# Altium project Iris.PrjPCB (part 2 of 2)

## Sheet Audio.SchDoc: Iris
size A3; Organization: Toradex AG; Address1: Altsagenstrasse 5; Address2: Horw; Address3: 6048; Address4: Switzerland; DocumentNumber: 13; Revision: V2.0; SheetNumber: 13; SheetTotal: 16
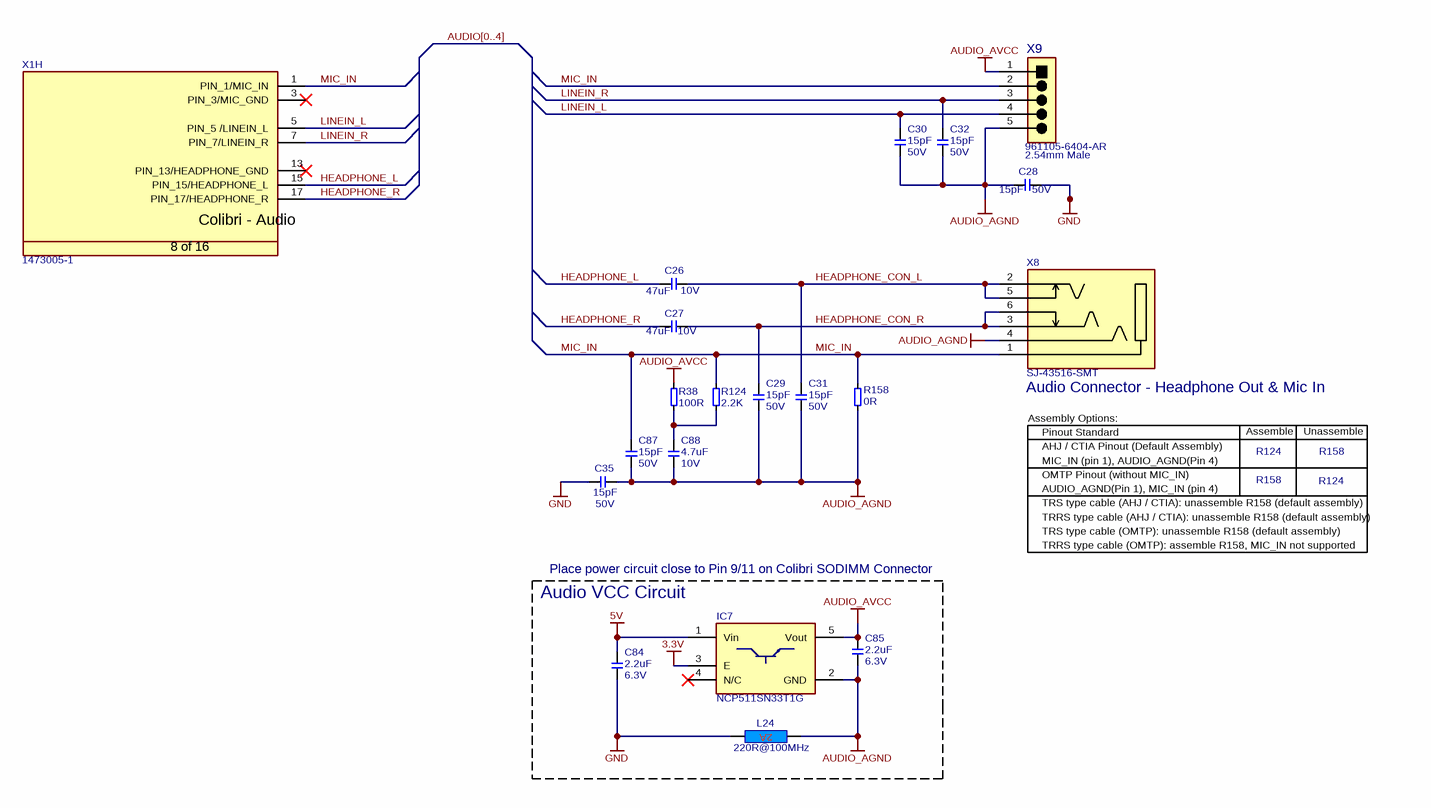
[diagram p9: Audio.SchDoc]

### Parts
C26  Rating: 10V  [T_CAPC0805X125N]  (hidden comment: 47uF)
C27  Rating: 10V  [T_CAPC0805X125N]  (hidden comment: 47uF)
C28  Rating: 50V  [CAPC1005X60N]  (hidden comment: 15pF)
C29  Rating: 50V  [CAPC1005X60N]  (hidden comment: 15pF)
C30  Rating: 50V  [CAPC1005X60N]  (hidden comment: 15pF)
C31  Rating: 50V  [CAPC1005X60N]  (hidden comment: 15pF)
C32  Rating: 50V  [CAPC1005X60N]  (hidden comment: 15pF)
C35  Rating: 50V  [CAPC1005X60N]  (hidden comment: 15pF)
C84  Rating: 6.3V  [T_CAPC0603X33N]  (hidden comment: 2.2uF)
C85  Rating: 6.3V  [T_CAPC0603X33N]  (hidden comment: 2.2uF)
C87  Rating: 50V  [CAPC1005X60N]  (hidden comment: 15pF)
C88  Rating: 10V  [T_CAPC0603X33N]  (hidden comment: 4.7uF)
IC7  NCP511SN33T1G  [SOT95P279X142-5N]
L24  220R@100MHz  [INDC1608X95N]
R38  100R  [T_RESC0603X30N]
R124  2.2K  [RESC1005X40N]
R158  0R  [T_RESC0603X30N]
X1  1473005-1  [T_Tyco_1473005-1]  (part H of 16)
X8  SJ-43516-SMT  [T_CI_SJ-43516-SMT]
X9  961105-6404-AR  [T_3M_961105-6404-AR]

### Blocks framed on the sheet
Audio VCC Circuit: C84 C85 IC7 L24

### Nets
3.3V: IC7.3(E)
5V: C84.2 IC7.1(Vin)
AUDIO_AGND: C28.1 C29.1 C30.1 C31.1 C32.1 C35.2 C85.1 C87.1 C88.1 IC7.2(GND) L24.1 R158.2 X8.4 X9.5
AUDIO_AVCC: C85.2 IC7.5(Vout) R38.1 X9.1
GND: C28.2 C35.1 C84.1 L24.2
HEADPHONE_CON_L: C26.2 C31.2 X8.2 X8.5
HEADPHONE_CON_R: C27.2 C29.2 X8.3 X8.6
HEADPHONE_L: C26.1 X1.15(PIN_15/HEADPHONE_L)
HEADPHONE_R: C27.1 X1.17(PIN_17/HEADPHONE_R)
LINEIN_L: C30.2 X1.5(PIN_5_/LINEIN_L) X9.4
LINEIN_R: C32.2 X1.7(PIN_7/LINEIN_R) X9.3
MIC_IN: C87.2 R124.2 R158.1 X1.1(PIN_1/MIC_IN) X8.1 X9.2
NetC88_2: C88.2 R38.2 R124.1

Not connected (* = marked no-connect by the designer): IC7 4(N/C)*; X1 3(PIN_3/MIC_GND)* 13(PIN_13/HEADPHONE_GND)*

### Buses and harness runs
bus AUDIO[0..4]

### Notes on the sheet
- 2.54mm Male
- (near X8) Audio Connector - Headphone Out & Mic In
- Assembly Options:
- AHJ / CTIA Pinout (Default Assembly)
- Pinout Standard
- Assemble
- R124
- Unassemble
- R158
- OMTP Pinout (without MIC_IN)
- MIC_IN (pin 1), AUDIO_AGND(Pin 4)
- AUDIO_AGND(Pin 1), MIC_IN (pin 4)
- TRS type cable (AHJ / CTIA): unassemble R158 (default assembly)
- TRRS type cable (AHJ / CTIA): unassemble R158 (default assembly)
- Place power circuit close to Pin 9/11 on Colibri SODIMM Connector
- TRRS type cable (OMTP): assemble R158, MIC_IN not supported
- TRS type cable (OMTP): unassemble R158 (default assembly)
- Title
- Size:
- Date:
- A3
- Number:
- Time:
- Revision:
- Sheet
- of
- File:
- (in symbol CON-Tyco-1473005-1-200-0.6mm, part H) Colibri - Audio; 8 of 16

### Library data of the parts
C26 C27 = C-X5R-47uF-10V-20%-0805: Capacitor Ceramic X5R 47uF 10V 20% 0805; Tolerance: 20%; Type: X5R; Value: 47uF
C28-C32 C35 C87 = C-NPO-15pF-50V-5%-0402: Capacitor Ceramic NPO 15pF 50V 5% 0402; Tolerance: 5%; Type: NPO; Value: 15pF
C84 C85 = C-X5R-2.2uF-6.3V-20%-0603: Capacitor Ceramic X5R 2.2uF 6.3V 20% 0603; Tolerance: 20%; Type: X5R; Value: 2.2uF
C88 = C-X5R-4.7uF-10V-10%-0603: Capacitor Ceramic X5R 4.7uF 10V 10% 0603; Manufacturer Name: Generic; Tolerance: 10%; Type: X5R; Manufacturer Part No.: *; Value: 4.7uF
IC7 = IC-ON-NCP511SN33T1G: NCP511SN33T1G LDO Regulator; Manufacturer Name: ON Semiconductor; Manufacturer Part No.: NCP511SN33T1G
L24 = L-220R@100MHz-2A-25%-0603: as L19 on sheet Ethernet; Rating: 2A; Value: 220R@100MHz
R38 = R-100R-63mW-5%-0603: Resistor 100 ohm 63mW 5% 0603; Rating: 63mW; Tolerance: 5%; Value: 100R
R124 = R-2.2KR-63mW-5%-0402: Resistor 2.2 Kohm 63mW 5% 0402; Value: 2.2KR; Rating: 63mW; Tolerance: 5%
R158 = R-0R-63mW-5%-0603: Resistor 0 ohm 63mW 5% 0603; Rating: 63mW; Tolerance: 5%; Value: 0R; Size: 0603 (In)
X1 = CON-Tyco-1473005-1-200-0.6mm: as X1 on sheet Colibri; Manufacturer Part No.: 1473005-1
X8 = CON-Cui-SJ-43516-SMT-6-3.5mm: 3.5mm Stereo Jack SMD with Detect Contact; Manufacturer Name: Cui INC; No. of ways: 6; Manufacturer Part No.: SJ-43516-SMT
X9 = CON-3M-961105-6404-AR: Audio Header 5 pins 2.54mm; Manufacturer Name: 3M; No. of ways: 1X5; Pitch: 2.54mm; Manufacturer Part No.: 961105-6404-AR

## Sheet USB.SchDoc: Iris
size A3; Organization: Toradex AG; Address1: Altsagenstrasse 5; Address2: Horw; Address3: 6048; Address4: Switzerland; DocumentNumber: 6; Revision: V2.0; SheetNumber: 6; SheetTotal: 16
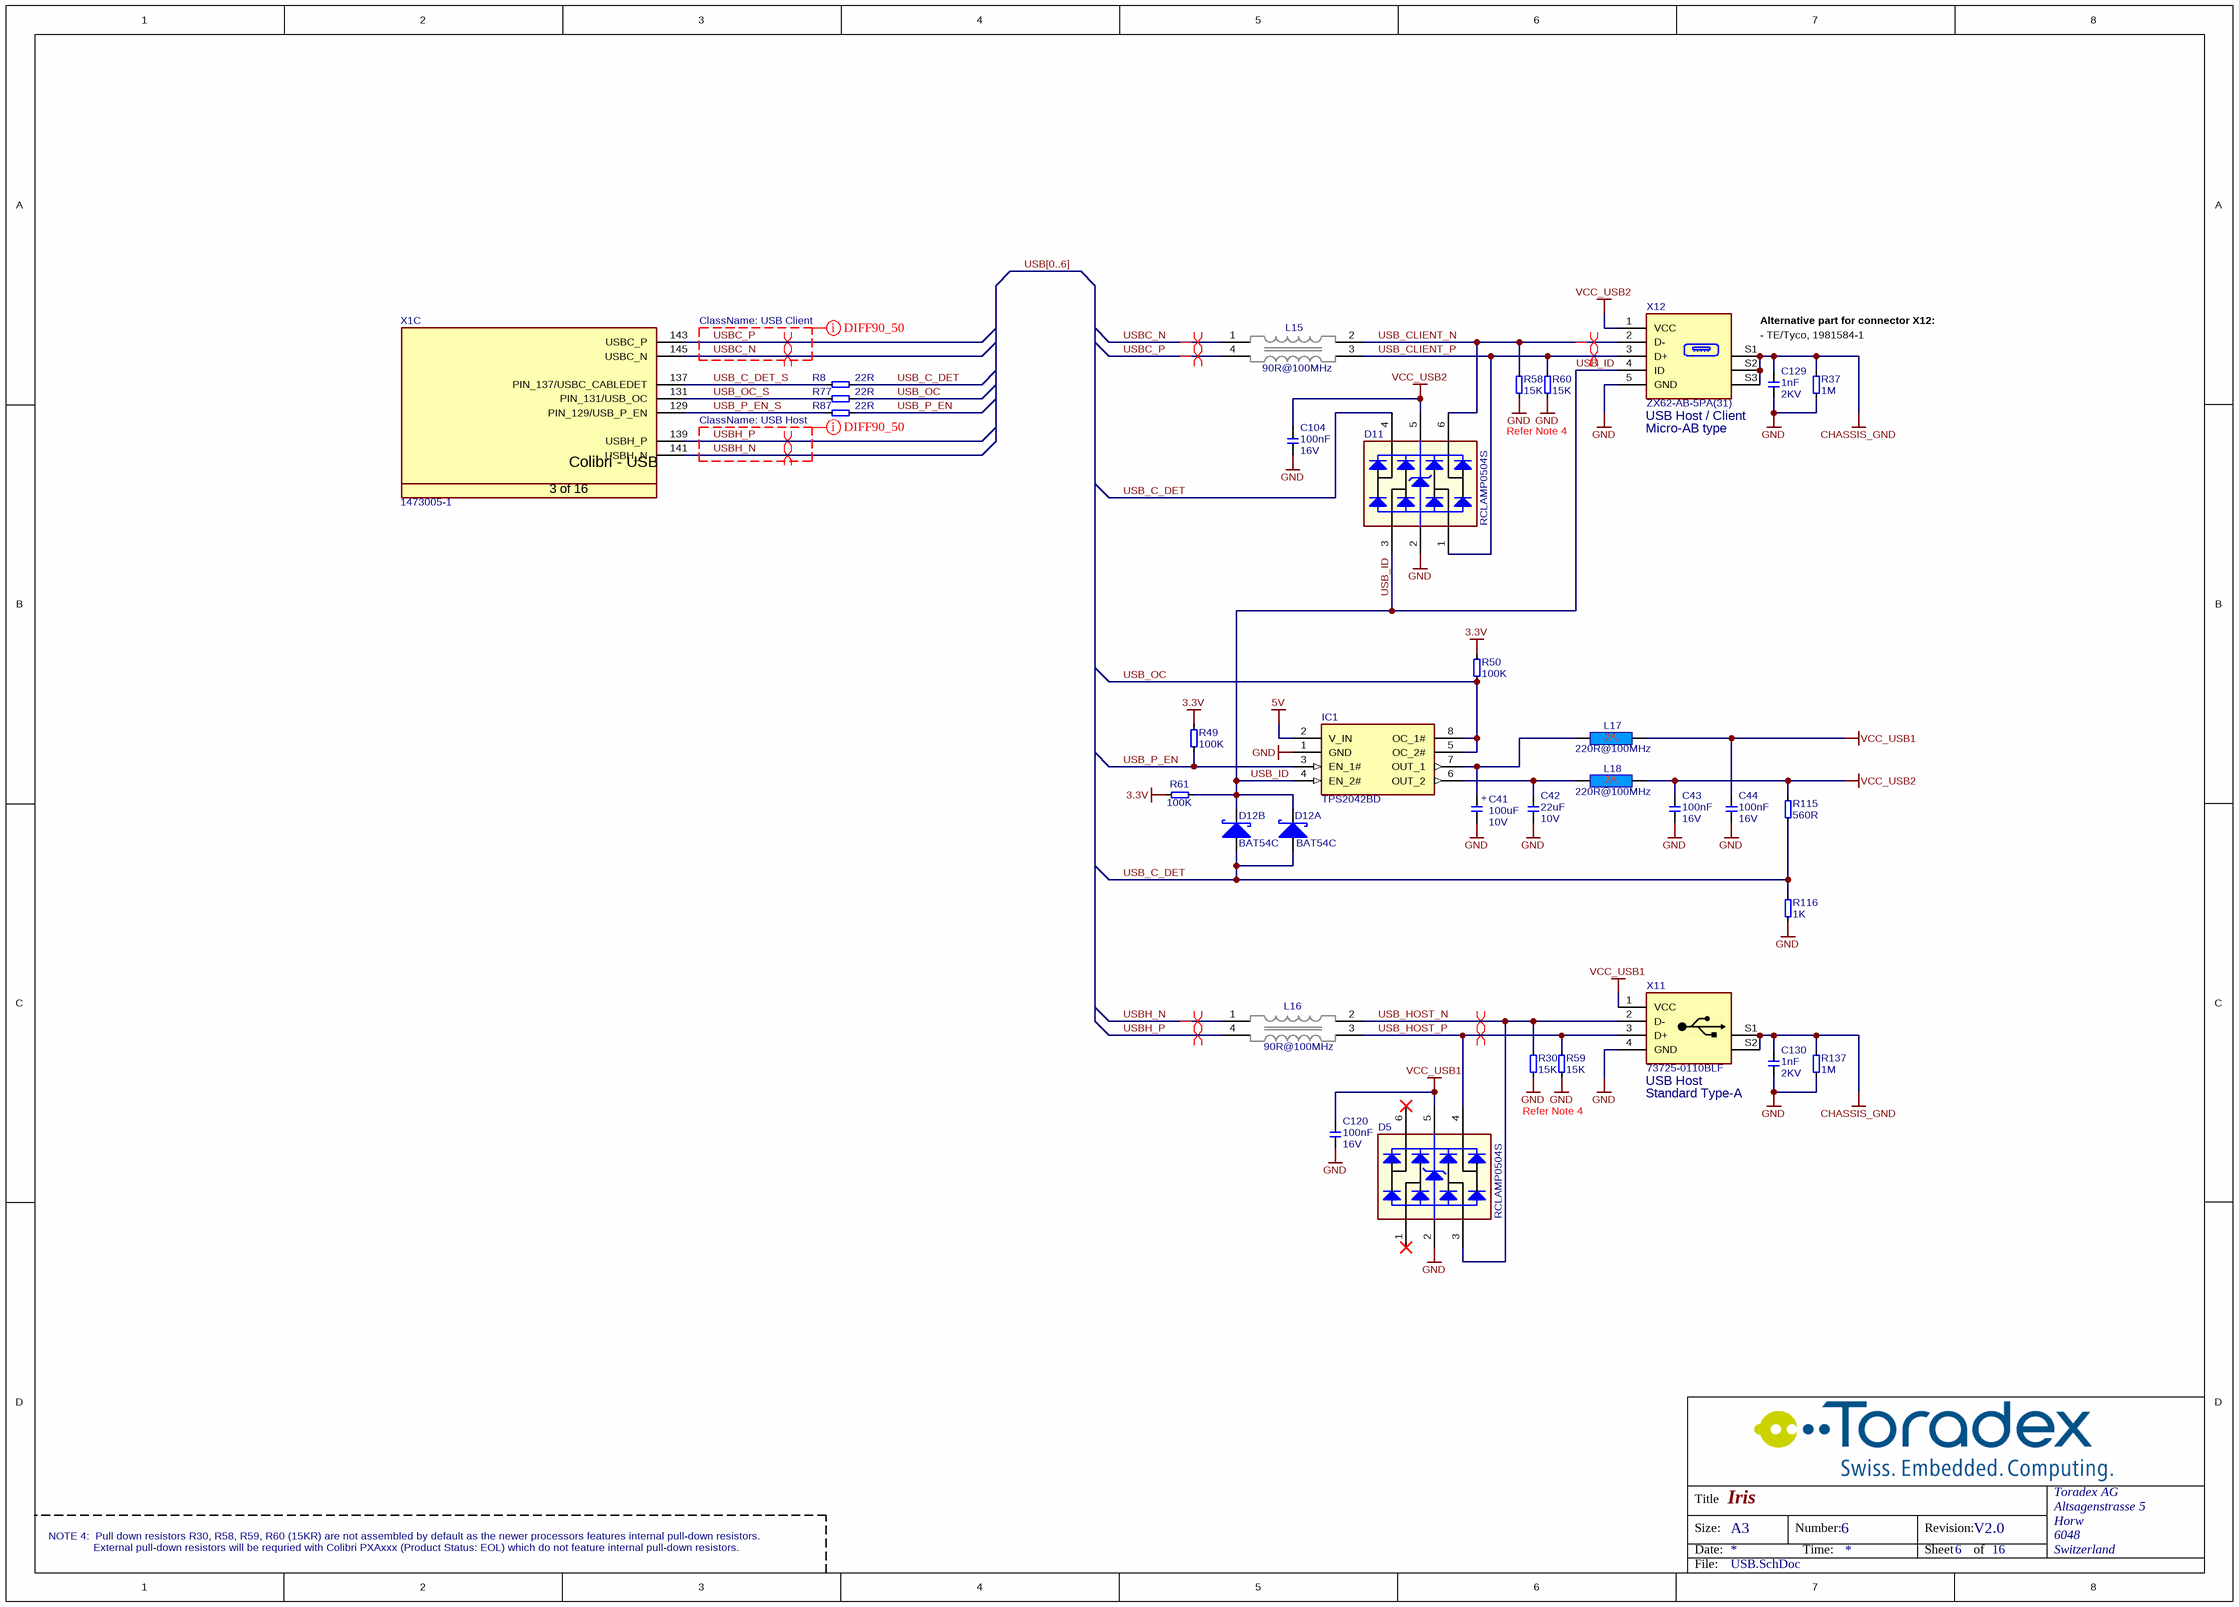
[diagram p10: USB.SchDoc]

### Parts
C41  Rating: 10V  [CAPMP3528X210N]  (hidden comment: 100uF)
C42  Rating: 10V  [T_CAPC0805X125N]  (hidden comment: 22uF)
C43  Rating: 16V  [CAPC1005X60N]  (hidden comment: 100nF)
C44  Rating: 16V  [CAPC1005X60N]  (hidden comment: 100nF)
C104  Rating: 16V  [CAPC1005X60N]  (hidden comment: 100nF)
C120  Rating: 16V  [CAPC1005X60N]  (hidden comment: 100nF)
C129  Rating: 2KV  [T_CAPC1206X180N]  (hidden comment: 1nF)
C130  Rating: 2KV  [T_CAPC1206X180N]  (hidden comment: 1nF)
D5  RCLAMP0504S  [T_SOT95P285X90-6N]
D11  RCLAMP0504S  [T_SOT95P285X90-6N]
D12  BAT54C  [SOT95P230X110-3N]  (parts A,B of 2)
IC1  TPS2042BD  [SOIC127P600X173-8N]
L15  90R@100MHz  [T_Murata_DLW21SN900SQ2]
L16  90R@100MHz  [T_Murata_DLW21SN900SQ2]
L17  220R@100MHz  [INDC1608X95N]
L18  220R@100MHz  [INDC1608X95N]
R8  22R  [RESC1005X40N]
R30  15K  [T_RESC0603X30N]
R37  1M  [T_RESC0603X30N]
R49  100K  [RESC1005X40N]
R50  100K  [RESC1005X40N]
R58  15K  [T_RESC0603X30N]
R59  15K  [T_RESC0603X30N]
R60  15K  [T_RESC0603X30N]
R61  100K  [RESC1005X40N]
R77  22R  [RESC1005X40N]
R87  22R  [RESC1005X40N]
R115  560R  [RESC1005X40N]
R116  1K  [RESC1005X40N]
R137  1M  [T_RESC0603X30N]
X1  1473005-1  [T_Tyco_1473005-1]  (part C of 16)
X11  Manufacturer Part No.: 73725-0110BLF  [T_FCI_73725-0110BLF]  (hidden comment: CON-Fci-73725-0110BLF)
X12  ZX62-AB-5PA(31)  [CON-MicroUSB2.0-Type_AB-SMD]

### Nets
3.3V: R49.2 R50.2 R61.2
5V: IC1.2(V_IN)
CHASSIS_GND: C129.2 C130.2 R37.2 R137.2 X11.S1 X11.S2 X12.S1 X12.S2 X12.S3
GND: C41.2 C42.1 C43.1 C44.1 C104.1 C120.1 C129.1 C130.1 D5.2 D11.2 IC1.1(GND) R30.1 R37.1 R58.1 R59.1 R60.1 R116.2 R137.1 X11.4(GND) X12.5(GND)
VCC_USB1: C44.2 C120.2 D5.5 L17.2 X11.1(VCC)
VCC_USB2: C43.2 C104.2 D11.5 L18.2 R115.1 X12.1(VCC)
USB_C_DET: D11.4 D12.1 D12.2 R8.2 R115.2 R116.1
USB_C_DET_S: R8.1 X1.137(PIN_137/USBC_CABLEDET)
USB_CLIENT_N: D11.6 L15.2 R58.2 X12.2(D-)
USB_CLIENT_P: D11.1 L15.3 R60.2 X12.3(D+)
USB_HOST_N: D5.3 L16.2 R30.2 X11.2(D-)
USB_HOST_P: D5.4 L16.3 R59.2 X11.3(D+)
USB_ID: D11.3 D12.3 IC1.4(EN_2#) R61.1 X12.4(ID)
USB_OC: IC1.5(OC_2#) IC1.8(OC_1#) R50.1 R77.2
USB_OC_S: R77.1 X1.131(PIN_131/USB_OC)
USB_P_EN: IC1.3(EN_1#) R49.1 R87.2
USB_P_EN_S: R87.1 X1.129(PIN_129/USB_P_EN)
USBC_N: L15.1 X1.145(USBC_N)
USBC_P: L15.4 X1.143(USBC_P)
USBH_N: L16.1 X1.141(USBH_N)
USBH_P: L16.4 X1.139(USBH_P)
NetC41_1: C41.1 IC1.7(OUT_1) L17.1
NetC42_2: C42.2 IC1.6(OUT_2) L18.1

Not connected (* = marked no-connect by the designer): D5 1* 6*

### Buses and harness runs
bus USB[0..6]

### Layout directives
differential pair: USB_CLIENT_N, USB_CLIENT_P, USB_HOST_N, USB_HOST_P, USBC_N, USBC_P, USBH_N, USBH_P
net class USB Client: USBC_N, USBC_P
net class USB Host: USBH_N, USBH_P

### Notes on the sheet
- (near X12) Alternative part for connector X12:
- - TE/Tyco, 1981584-1
- Refer Note 4
- USB Host / Client
- Micro-AB type
- (near X11) USB Host
- Standard Type-A
- NOTE 4:  Pull down resistors R30, R58, R59, R60 (15KR) are not assembled by default as the newer processors features internal pull-down resistors.
- External pull-down resistors will be requried with Colibri PXAxxx (Product Status: EOL) which do not feature internal pull-down resistors.
- Title
- Size:
- Date:
- A3
- Number:
- Time:
- Revision:
- Sheet
- of
- File:
- (in symbol C-TA-100uF-10V-20%-3528) +
- (in symbol CON-Tyco-1473005-1-200-0.6mm, part C) Colibri - USB; 3 of 16

### Library data of the parts
C41 = C-TA-100uF-10V-20%-3528: Capacitor TA 100uF 10V 20% 3528; Tolerance: 20%; Type: TA; Value: 100uF
C42 = C-X5R-22uF-10V-20%-0805: Capacitor Ceramic X5R 22uF 10V 20% 0805; Tolerance: 20%; Type: X5R; Value: 22uF
C43 C44 C104 C120 = C-X7R-100nF-16V-10%-0402: Capacitor Ceramic X7R 100nF 16V 10% 0402; Tolerance: 10%; Type: X7R; Value: 100nF
C129 C130 = C-X7R-1nF-2KV-10%-1206: Capacitor Ceramic X7R 1nF 2KV 10% 1206; Tolerance: 10%; Type: X7R; Value: 1nF
D5 D11 = D-Semtech-RClamp0504S: TVS Array low cap; Manufacturer Name: Semtech; Manufacturer Part No.: RCLAMP0504S
D12 = D-Philips-BAT54C-Schottky: BAT54C Schottky Diode; Manufacturer Name: Philips; Manufacturer Part No.: BAT54C
IC1 = IC-TI-TPS2042BD: Dual High Side Switch With OC_DET 500mA/CH; Manufacturer Name: Texas Instruments; Manufacturer Part No.: TPS2042BD
L15 L16 = L-Murata-DLW21SN900SQ2-90R@100MHz-330mA-25%: Common Mode Choke High Speed 90R 330mA; Manufacturer Name: Murata; Tolerance: 25%; Rating: 330mA; Manufacturer Part No.: DLW21SN900SQ2; Value: 90R@100MHz
L17 L18 = L-220R@100MHz-2A-25%-0603: 220R@100MHz 2A EMI FILTER; Tolerance: 25%; Rating: 2A; Value: 220R@100MHz
R8 R77 R87 = R-22R-63mW-5%-0402: Resistor 22 ohm 63mW 5% 0402; Rating: 63mW; Tolerance: 5%; Value: 22R
R30 R58-R60 = R-15KR-63mW-5%-0603: Resistor 15 Kohm 63mW 5% 0603; Value: 15KR; Rating: 63mW; Tolerance: 5%
R37 R137 = R-1MR-63mW-5%-0603: Resistor 1 Mohm 63mW 5% 0603; Value: 1MR; Rating: 63mW; Tolerance: 5%
R49 R50 R61 = R-100KR-63mW-5%-0402: Resistor 100 Kohm 63mW 5% 0402; Value: 100KR; Rating: 63mW; Tolerance: 5%
R115 = R-560R-63mW-5%-0402: Resistor 560 ohm 63mW 5% 0402; Rating: 63mW; Tolerance: 5%; Value: 560R
R116 = R-1KR-63mW-5%-0402: Resistor 1 Kohm 63mW 5% 0402; Rating: 63mW; Tolerance: 5%; Value: 1K
X1 = CON-Tyco-1473005-1-200-0.6mm: SODIMM Connector; Manufacturer Name: Tyco; No. of ways: 200; Manufacturer Part No.: 1473005-1
X11 = CON-Fci-73725-0110BLF: USB Type A Connector; Manufacturer Name: FCI; No. of ways: 4
X12 = CON-Hirose-ZX62-AB-5PA(31): Micro AB USB-2.0, 5 Position, Surface Mount, Right Angle, Horizontal; Manufacturer Name: Hirose; No. of ways: 5; Manufacturer Part No.: ZX62-AB-5PA(31)

## Sheet Serial.SchDoc: Iris
size A3; Organization: Toradex AG; Address1: Altsagenstrasse 5; Address2: Horw; Address3: 6048; Address4: Switzerland; DocumentNumber: 14; Revision: V2.0; SheetNumber: 14; SheetTotal: 16
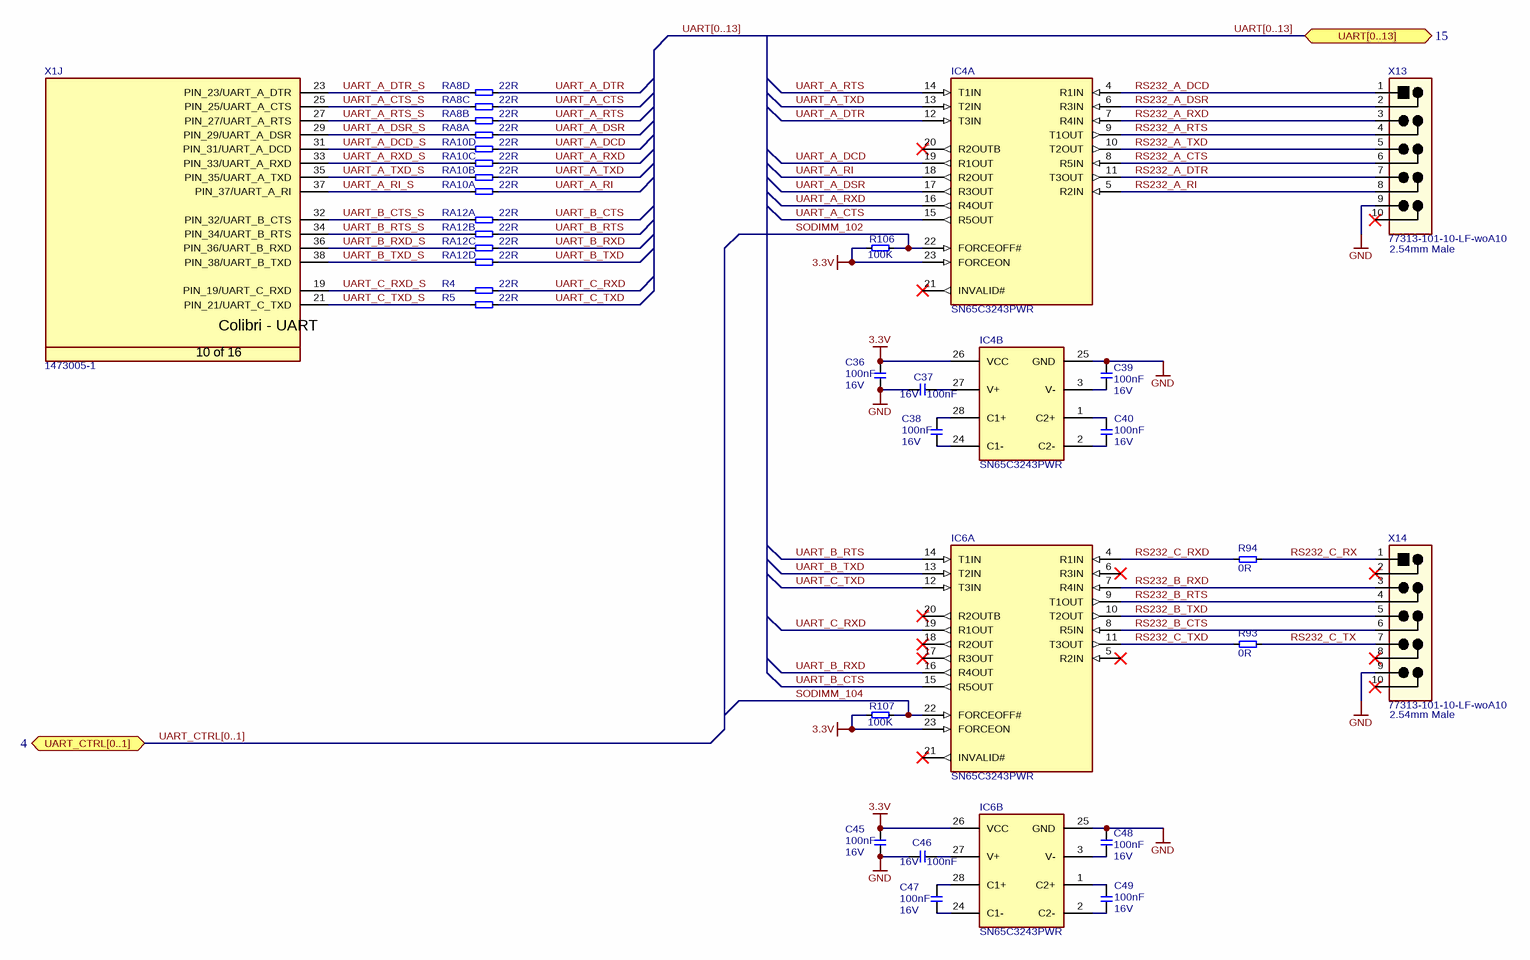
[diagram p11: Serial.SchDoc]

### Parts
C36  Rating: 16V  [CAPC1005X60N]  (hidden comment: 100nF)
C37  Rating: 16V  [CAPC1005X60N]  (hidden comment: 100nF)
C38  Rating: 16V  [CAPC1005X60N]  (hidden comment: 100nF)
C39  Rating: 16V  [CAPC1005X60N]  (hidden comment: 100nF)
C40  Rating: 16V  [CAPC1005X60N]  (hidden comment: 100nF)
C45  Rating: 16V  [CAPC1005X60N]  (hidden comment: 100nF)
C46  Rating: 16V  [CAPC1005X60N]  (hidden comment: 100nF)
C47  Rating: 16V  [CAPC1005X60N]  (hidden comment: 100nF)
C48  Rating: 16V  [CAPC1005X60N]  (hidden comment: 100nF)
C49  Rating: 16V  [CAPC1005X60N]  (hidden comment: 100nF)
IC4  SN65C3243PWR  [SOP65P780X200-28N]  (parts A,B of 2)
IC6  SN65C3243PWR  [SOP65P780X200-28N]  (parts A,B of 2)
R4  22R  [RESC1005X40N]
R5  22R  [RESC1005X40N]
R93  0R  [T_RESC0603X30N]
R94  0R  [T_RESC0603X30N]
R106  100K  [T_RESC0603X30N]
R107  100K  [T_RESC0603X30N]
RA8  22R  [T_Resistor_Array_X4]  (parts A,B,C,D of 4)
RA10  22R  [T_Resistor_Array_X4]  (parts A,B,C,D of 4)
RA12  22R  [T_Resistor_Array_X4]  (parts A,B,C,D of 4)
X1  1473005-1  [T_Tyco_1473005-1]  (part J of 16)
X13  77313-101-10-LF-woA10  [T_FCI_77313-101-10-LF-woA10]
X14  77313-101-10-LF-woA10  [T_FCI_77313-101-10-LF-woA10]

### Ports
UART[0..13] (bidir, see 15), UART_CTRL[0..1] (bidir, see 4)

### Nets
3.3V: C36.2 C45.2 IC4.23(FORCEON) IC4.26(VCC) IC6.23(FORCEON) IC6.26(VCC) R106.1 R107.1
GND: C36.1 C37.1 C39.2 C45.1 C46.1 C48.2 IC4.25(GND) IC6.25(GND) X13.9 X14.9
RS232_A_CTS: IC4.8(R5IN) X13.6
RS232_A_DCD: IC4.4(R1IN) X13.1
RS232_A_DSR: IC4.6(R3IN) X13.2
RS232_A_DTR: IC4.11(T3OUT) X13.7
RS232_A_RI: IC4.5(R2IN) X13.8
RS232_A_RTS: IC4.9(T1OUT) X13.4
RS232_A_RXD: IC4.7(R4IN) X13.3
RS232_A_TXD: IC4.10(T2OUT) X13.5
RS232_B_CTS: IC6.8(R5IN) X14.6
RS232_B_RTS: IC6.9(T1OUT) X14.4
RS232_B_RXD: IC6.7(R4IN) X14.3
RS232_B_TXD: IC6.10(T2OUT) X14.5
RS232_C_RX: R94.2 X14.1
RS232_C_RXD: IC6.4(R1IN) R94.1
RS232_C_TX: R93.2 X14.7
RS232_C_TXD: IC6.11(T3OUT) R93.1
SODIMM_102: IC4.22(FORCEOFF#) R106.2
SODIMM_104: IC6.22(FORCEOFF#) R107.2
UART_A_CTS: IC4.15(R5OUT) RA8.7
UART_A_CTS_S: RA8.3 X1.25(PIN_25/UART_A_CTS)
UART_A_DCD: IC4.19(R1OUT) RA10.8
UART_A_DCD_S: RA10.4 X1.31(PIN_31/UART_A_DCD)
UART_A_DSR: IC4.17(R3OUT) RA8.5
UART_A_DSR_S: RA8.1 X1.29(PIN_29/UART_A_DSR)
UART_A_DTR: IC4.12(T3IN) RA8.8
UART_A_DTR_S: RA8.4 X1.23(PIN_23/UART_A_DTR)
UART_A_RI: IC4.18(R2OUT) RA10.5
UART_A_RI_S: RA10.1 X1.37(PIN_37/UART_A_RI)
UART_A_RTS: IC4.14(T1IN) RA8.6
UART_A_RTS_S: RA8.2 X1.27(PIN_27/UART_A_RTS)
UART_A_RXD: IC4.16(R4OUT) RA10.7
UART_A_RXD_S: RA10.3 X1.33(PIN_33/UART_A_RXD)
UART_A_TXD: IC4.13(T2IN) RA10.6
UART_A_TXD_S: RA10.2 X1.35(PIN_35/UART_A_TXD)
UART_B_CTS: IC6.15(R5OUT) RA12.5
UART_B_CTS_S: RA12.1 X1.32(PIN_32/UART_B_CTS)
UART_B_RTS: IC6.14(T1IN) RA12.6
UART_B_RTS_S: RA12.2 X1.34(PIN_34/UART_B_RTS)
UART_B_RXD: IC6.16(R4OUT) RA12.7
UART_B_RXD_S: RA12.3 X1.36(PIN_36/UART_B_RXD)
UART_B_TXD: IC6.13(T2IN) RA12.8
UART_B_TXD_S: RA12.4 X1.38(PIN_38/UART_B_TXD)
UART_C_RXD: IC6.19(R1OUT) R4.2
UART_C_RXD_S: R4.1 X1.19(PIN_19/UART_C_RXD)
UART_C_TXD: IC6.12(T3IN) R5.2
UART_C_TXD_S: R5.1 X1.21(PIN_21/UART_C_TXD)
NetC37_2: C37.2 IC4.27(V+)
NetC38_1: C38.1 IC4.24(C1-)
NetC38_2: C38.2 IC4.28(C1+)
NetC39_1: C39.1 IC4.3(V-)
NetC40_1: C40.1 IC4.2(C2-)
NetC40_2: C40.2 IC4.1(C2+)
NetC46_2: C46.2 IC6.27(V+)
NetC47_1: C47.1 IC6.24(C1-)
NetC47_2: C47.2 IC6.28(C1+)
NetC48_1: C48.1 IC6.3(V-)
NetC49_1: C49.1 IC6.2(C2-)
NetC49_2: C49.2 IC6.1(C2+)

Not connected (* = marked no-connect by the designer): IC4 20(R2OUTB)* 21(INVALID#)*; IC6 5(R2IN)* 6(R3IN)* 17(R3OUT)* 18(R2OUT)* 20(R2OUTB)* 21(INVALID#)*; X13 10*; X14 2* 8* 10*

### Buses and harness runs
bus UART[0..13] = port UART[0..13]
bus UART_CTRL[0..1] = port UART_CTRL[0..1]

### Notes on the sheet
- (near X13) 2.54mm Male
- (near X14) 2.54mm Male
- Title
- Size:
- Date:
- A3
- Number:
- Time:
- Revision:
- Sheet
- of
- File:
- (in symbol CON-Tyco-1473005-1-200-0.6mm, part J) Colibri - UART; 10 of 16

### Library data of the parts
C36-C40 C45-C49 = C-X7R-100nF-16V-10%-0402: Capacitor Ceramic X7R 100nF 16V 10% 0402; Tolerance: 10%; Type: X7R; Value: 100nF
IC4 IC6 = IC-TI-SN65C3243PWR: RS-232 Serial Transceiver; Manufacturer Name: Texas Instruments; Manufacturer Part No.: SN65C3243PWR
R4 R5 = R-22R-63mW-5%-0402: Resistor 22 ohm 63mW 5% 0402; Rating: 63mW; Tolerance: 5%; Value: 22R
R93 R94 = R-0R-63mW-5%-0603: Resistor 0 ohm 63mW 5% 0603; Tolerance: 5%; Value: 0R; Rating: 63mW; Size: 0603 (In)
R106 R107 = R-100KR-63mW-5%-0603: Resistor 100 Kohm 63mW 5% 0603; Value: 100KR; Rating: 63mW; Tolerance: 5%
RA8 RA10 RA12 = RA-22R-63mW-5%-1206-div: Resistor Array 22 R 63mW 5% 1206; Manufacturer Name: Generic; Tolerance: 5%; Power Dissipation: 63mW; Manufacturer Part Number: *; Value: 22R
X1 = CON-Tyco-1473005-1-200-0.6mm: as X1 on sheet USB; Manufacturer Part No.: 1473005-1
X13 X14 = CON-Fci-77313-101-10-LF-woA10-9-2.54mm: RS232 Header; Manufacturer Name: FCI; No. of ways: 9; Manufacturer Part No.: 77313-101-10-LF-woA10

## Sheet RTC.SchDoc: Iris
size A3; Organization: Toradex AG; Address1: Altsagenstrasse 5; Address2: Horw; Address3: 6048; Address4: Switzerland; DocumentNumber: 8; Revision: V2.0; SheetNumber: 8; SheetTotal: 16
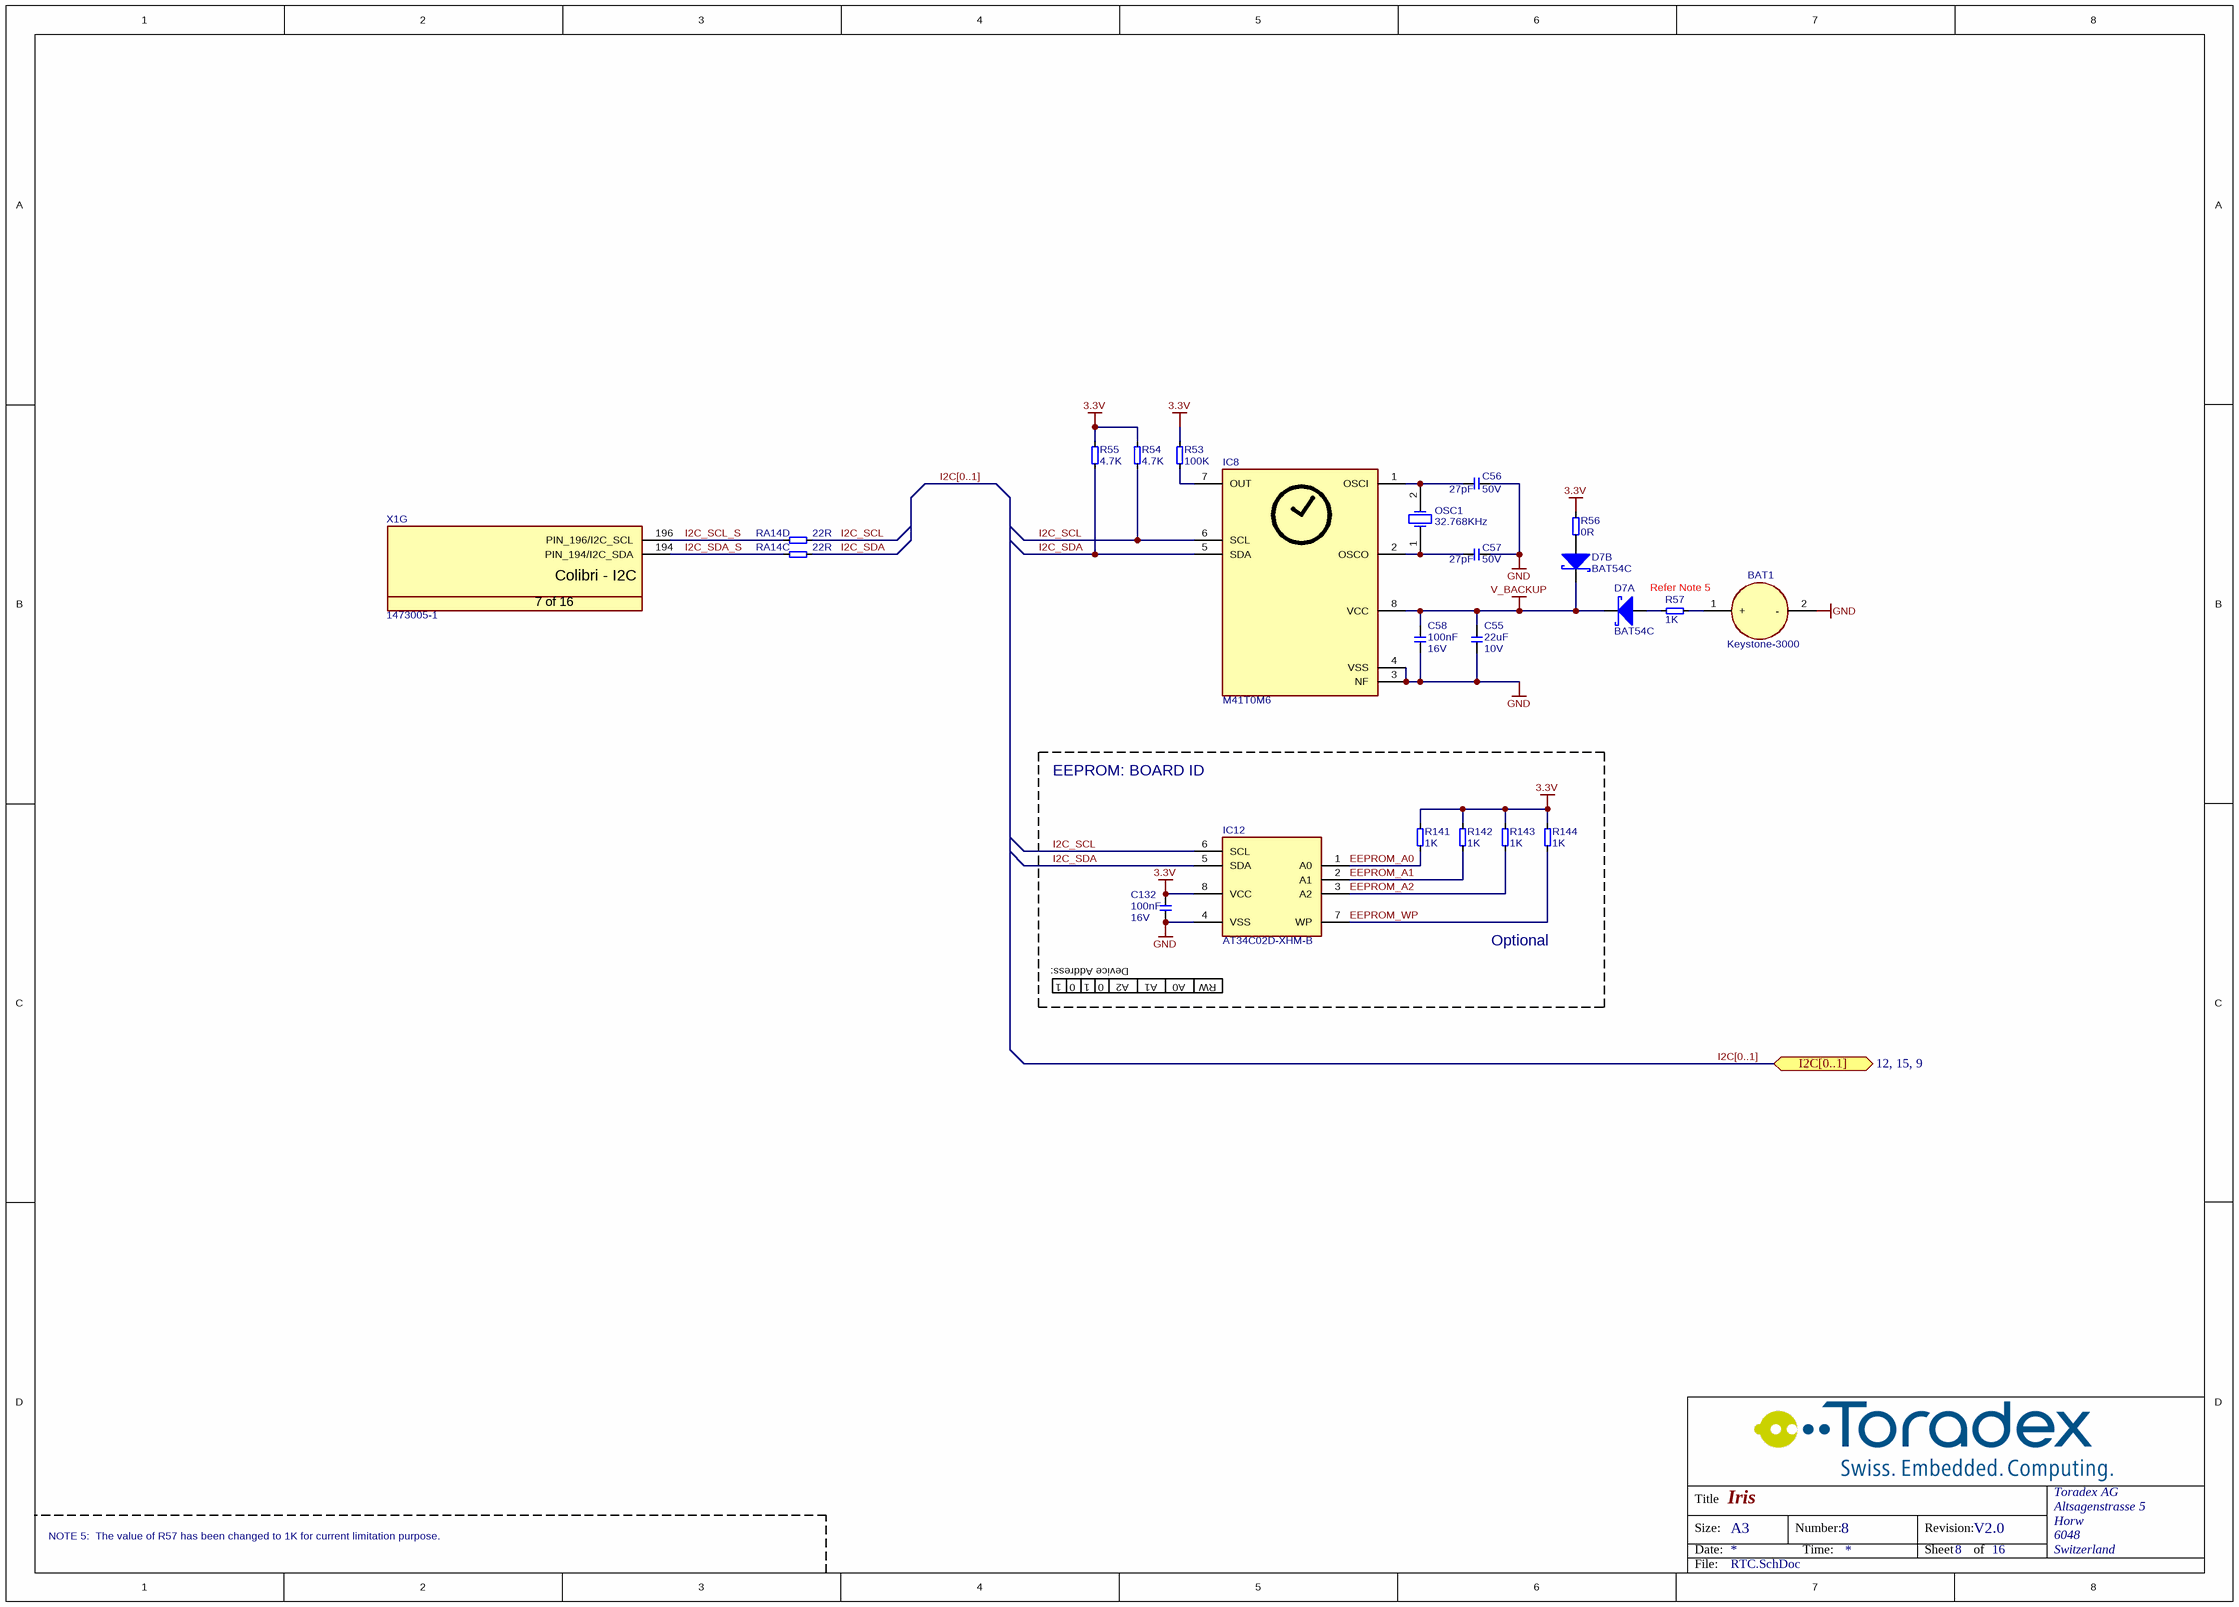
[diagram p12: RTC.SchDoc]

### Parts
BAT1  Keystone-3000  [T_Keystone_3000]
C55  Rating: 10V  [T_CAPC0805X125N]  (hidden comment: 22uF)
C56  Rating: 50V  [T_CAPC0603X33N]  (hidden comment: 27pF)
C57  Rating: 50V  [T_CAPC0603X33N]  (hidden comment: 27pF)
C58  Rating: 16V  [CAPC1005X60N]  (hidden comment: 100nF)
C132  Rating: 16V  [CAPC1005X60N]  (hidden comment: 100nF)
D7  BAT54C  [SOT95P230X110-3N]  (parts A,B of 2)
IC8  M41T0M6  [SOIC127P600X173-8N]
IC12  AT34C02D-XHM-B  [TSOP65P650X120-8M]
OSC1  value 32.768KHz  [T_MC_CC4V-T1A]  (hidden comment: CC4V-T1A)
R53  100K  [T_RESC0603X30N]
R54  4.7K  [RESC1005X40N]
R55  4.7K  [RESC1005X40N]
R56  0R  [T_RESC0603X30N]
R57  1K  [RESC1005X40N]
R141  1K  [T_RESC0603X30N]
R142  1K  [T_RESC0603X30N]
R143  1K  [T_RESC0603X30N]
R144  1K  [T_RESC0603X30N]
RA14  22R  [T_Resistor_Array_X4]  (parts C,D of 4)
X1  1473005-1  [T_Tyco_1473005-1]  (part G of 16)

### Ports
I2C[0..1] (bidir, see 12, 15, 9)

### Nets
3.3V: C132.2 IC12.8(VCC) R53.2 R54.2 R55.2 R56.2 R141.2 R142.2 R143.2 R144.2
GND: BAT1.2(-) C55.1 C56.1 C57.1 C58.1 C132.1 IC8.3(NF) IC8.4(VSS) IC12.4(VSS)
V_BACKUP: C55.2 C58.2 D7.3 IC8.8(VCC)
EEPROM_A0: IC12.1(A0) R141.1
EEPROM_A1: IC12.2(A1) R142.1
EEPROM_A2: IC12.3(A2) R143.1
EEPROM_WP: IC12.7(WP) R144.1
I2C_SCL: IC8.6(SCL) IC12.6(SCL) R54.1 RA14.8
I2C_SCL_S: RA14.4 X1.196(PIN_196/I2C_SCL)
I2C_SDA: IC8.5(SDA) IC12.5(SDA) R55.1 RA14.7
I2C_SDA_S: RA14.3 X1.194(PIN_194/I2C_SDA)
NetBAT1_1: BAT1.1(+) R57.1
NetC56_2: C56.2 IC8.1(OSCI) OSC1.2(OSC2)
NetC57_2: C57.2 IC8.2(OSCO) OSC1.1(OSC1)
NetD7_1: D7.1 R57.2
NetD7_2: D7.2 R56.1
NetIC8_7: IC8.7(OUT) R53.1

### Buses and harness runs
bus I2C[0..1] = port I2C[0..1]

### Notes on the sheet
- Refer Note 5
- EEPROM: BOARD ID
- 1
- 0
- Device Address:
- A2
- A1
- A0
- RW
- Optional
- NOTE 5:  The value of R57 has been changed to 1K for current limitation purpose.
- Title
- Size:
- Date:
- A3
- Number:
- Time:
- Revision:
- Sheet
- of
- File:
- (in symbol CON-Tyco-1473005-1-200-0.6mm, part G) Colibri - I2C; 7 of 16

### Library data of the parts
BAT1 = BAT-Keystone-3000: Battery Holder; Manufacturer Part No.: 3000; Manufacturer Name: Keystone
C55 = C-X5R-22uF-10V-20%-0805: Capacitor Ceramic X5R 22uF 10V 20% 0805; Tolerance: 20%; Type: X5R; Value: 22uF
C56 C57 = C-NPO-27pF-50V-5%-0603: Capacitor Ceramic NPO 27pF 50V 5% 0603; Tolerance: 5%; Type: NPO; Value: 27pF
C58 C132 = C-X7R-100nF-16V-10%-0402: Capacitor Ceramic X7R 100nF 16V 10% 0402; Tolerance: 10%; Type: X7R; Value: 100nF
D7 = D-Philips-BAT54C-Schottky: BAT54C Schottky Diode; Manufacturer Name: Philips; Manufacturer Part No.: BAT54C
IC8 = IC-ST-M41T0M6: RTC M41T0M6; Manufacturer Name: ST; Manufacturer Part No.: M41T0M6
IC12 = IC-Microchip-AT34C02D-XHM-B: EEPROM, 2Kbit (256 x 8), TSSOP-8 package; Manufacturer Name: Microchip; Manufacturer Part No.: AT34C02D-XHM-B
OSC1 = OSC-MC-CC4V-T1A-32.768KHz-30ppm-5x1.9mm: Quartz 32.768kHz; Manufacturer Name: Micro Crystal; Tolerance: 30ppm; Manufacturer Part No.: CC4V-T1A
R53 = R-100KR-63mW-5%-0603: as R106 on sheet Serial; Rating: 63mW; Tolerance: 5%
R54 R55 = R-4.7kR-63mW-5%-0402: Resistor 4.7 Kohm 63mW 5% 0402; Value: 4.7KR; Rating: 63mW; Tolerance: 5%
R56 = R-0R-63mW-5%-0603: Resistor 0 ohm 63mW 5% 0603; Rating: 63mW; Tolerance: 5%; Value: 0R; Size: 0603 (In)
R57 = R-1KR-63mW-5%-0402: Resistor 1 Kohm 63mW 5% 0402; Rating: 63mW; Tolerance: 5%; Value: 1K
R141-R144 = R-1KR-63mW-5%-0603: Resistor 1 Kohm 63mW 5% 0603; Rating: 63mW; Tolerance: 5%; Value: 1K
RA14 = RA-22R-63mW-5%-1206-div: as RA8 on sheet Serial; Tolerance: 5%; Power Dissipation: 63mW; Manufacturer Part Number: *; Value: 22R
X1 = CON-Tyco-1473005-1-200-0.6mm: as X1 on sheet USB; Manufacturer Part No.: 1473005-1

## Sheet Mechanicals.SchDoc: Iris
size A3; Organization: Toradex AG; Address1: Altsagenstrasse 5; Address2: Horw; Address3: 6048; Address4: Switzerland; DocumentNumber: 16; Revision: V2.0; SheetNumber: 16; SheetTotal: 16
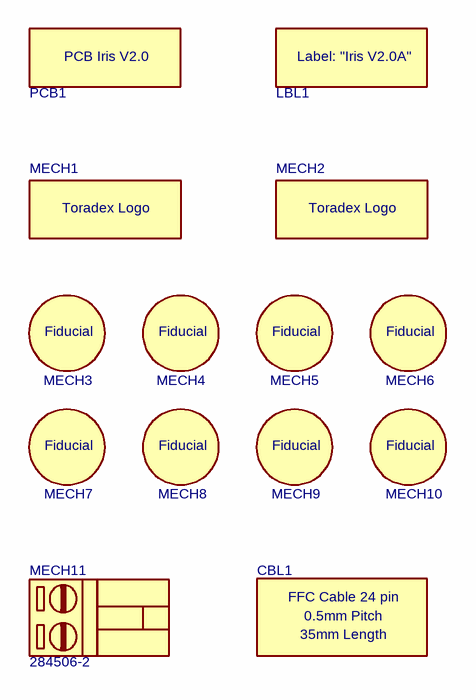
[diagram p13: Mechanicals.SchDoc]

### Parts
CBL1  FFC Cable  (value not drawn)
LBL1  Barcode Label  [T_BARCODE_LABEL]  (value not drawn)
MECH1  Toradex_Logo  [T_TORADEX_LOGO]  (value not drawn)
MECH2  Toradex_Logo  [T_TORADEX_LOGO]  (value not drawn)
MECH3  MECH-Fiducial  [T_Fiducial]  (value not drawn)
MECH4  MECH-Fiducial  [T_Fiducial]  (value not drawn)
MECH5  MECH-Fiducial  [T_Fiducial]  (value not drawn)
MECH6  MECH-Fiducial  [T_Fiducial]  (value not drawn)
MECH7  MECH-Fiducial  [T_Fiducial]  (value not drawn)
MECH8  MECH-Fiducial  [T_Fiducial]  (value not drawn)
MECH9  MECH-Fiducial  [T_Fiducial]  (value not drawn)
MECH10  MECH-Fiducial  [T_Fiducial]  (value not drawn)
MECH11  284506-2
PCB1  MECH-Iris  (value not drawn)

### Notes on the sheet
- Title
- Size:
- Date:
- A3
- Number:
- Time:
- Revision:
- Sheet
- of
- File:
- (in symbol MECH-FFC-Cable-top/top-24-35mm-0.5mm) FFC Cable 24 pin; 0.5mm Pitch; 35mm Length
- (in symbol PCB-Iris) PCB Iris V2.0
- (in symbol Toradex_Logo) Toradex Logo

### Library data of the parts
CBL1 = MECH-FFC-Cable-top/top-24-35mm-0.5mm: FFC Cable 24 pin 35mm 0.5mm pitch; Manufacturer Name: Generic; Manufacturer Part No.: *
LBL1 = Label: "Iris V2.0A": Manufacturer Name: Generic; Manufacturer Part No.: Barcode Label
MECH3-MECH10 = MECH-Fiducial: Fiducial
MECH11 = CON-Tyco-284506-2-1x2-Mate: Terminal Block Power Connector Mate; Manufacturer Name: Tyco; No. of ways: 1x2; Pitch: 3.5mm; Manufacturer Part No.: 284506-2
PCB1 = PCB-Iris: PCB Iris; Manufacturer Name: Generic; Manufacturer Part No.: *

## Sheet DVI.SchDoc: Iris
size A3; Organization: Toradex AG; Address1: Altsagenstrasse 5; Address2: Horw; Address3: 6048; Address4: Switzerland; DocumentNumber: 11; Revision: V2.0; SheetNumber: 11; SheetTotal: 16
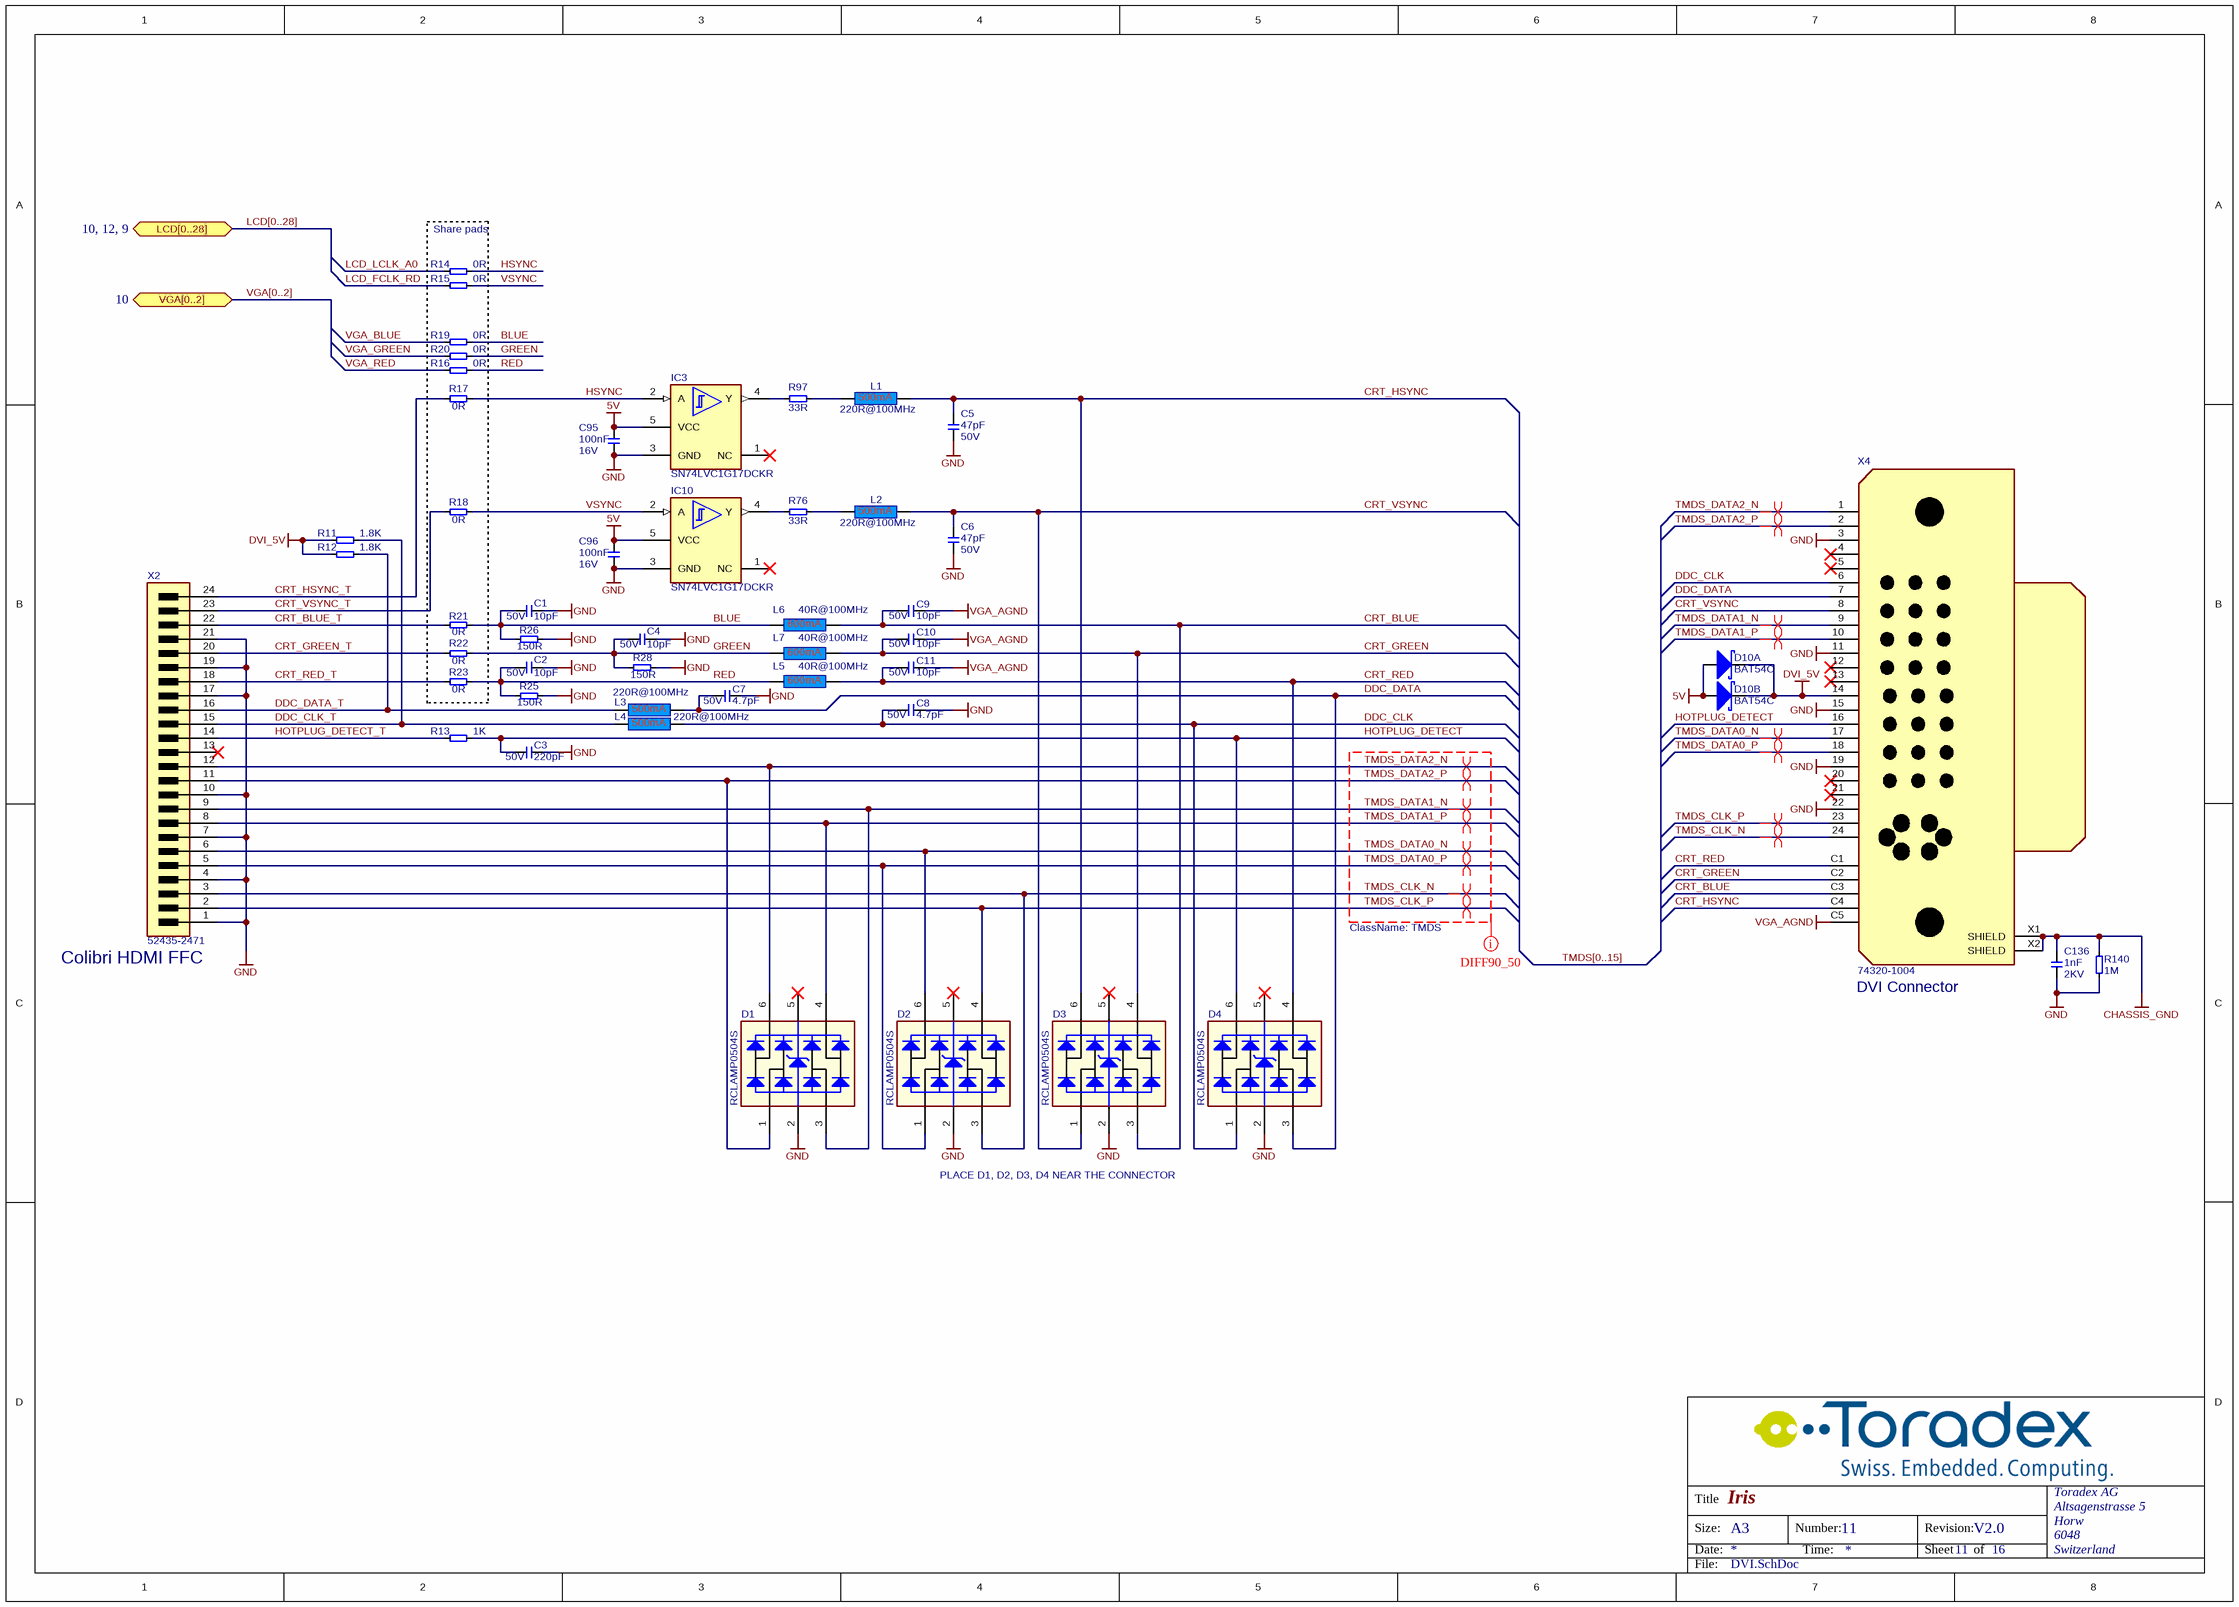
[diagram p14: DVI.SchDoc]

### Parts
C1  Rating: 50V  [CAPC1005X60N]  (hidden comment: 10pF)
C2  Rating: 50V  [CAPC1005X60N]  (hidden comment: 10pF)
C3  Rating: 50V  [CAPC1005X60N]  (hidden comment: 220pF)
C4  Rating: 50V  [CAPC1005X60N]  (hidden comment: 10pF)
C5  Rating: 50V  [CAPC1005X60N]  (hidden comment: 47pF)
C6  Rating: 50V  [CAPC1005X60N]  (hidden comment: 47pF)
C7  Rating: 50V  [CAPC1005X60N]  (hidden comment: 4.7pF)
C8  Rating: 50V  [CAPC1005X60N]  (hidden comment: 4.7pF)
C9  Rating: 50V  [CAPC1005X60N]  (hidden comment: 10pF)
C10  Rating: 50V  [CAPC1005X60N]  (hidden comment: 10pF)
C11  Rating: 50V  [CAPC1005X60N]  (hidden comment: 10pF)
C95  Rating: 16V  [CAPC1005X60N]  (hidden comment: 100nF)
C96  Rating: 16V  [CAPC1005X60N]  (hidden comment: 100nF)
C136  Rating: 2KV  [T_CAPC1206X180N]  (hidden comment: 1nF)
D1  RCLAMP0504S  [T_SOT95P285X90-6N]
D2  RCLAMP0504S  [T_SOT95P285X90-6N]
D3  RCLAMP0504S  [T_SOT95P285X90-6N]
D4  RCLAMP0504S  [T_SOT95P285X90-6N]
D10  BAT54C  [SOT95P230X110-3N]  (parts A,B of 2)
IC3  SN74LVC1G17DCKR  [SOT65P210X110-5N]
IC10  SN74LVC1G17DCKR  [SOT65P210X110-5N]
L1  220R@100MHz  [INDC1005X55N]
L2  220R@100MHz  [INDC1005X55N]
L3  220R@100MHz  [INDC1005X55N]
L4  220R@100MHz  [INDC1005X55N]
L5  40R@100MHz  [INDC1608X95N]
L6  40R@100MHz  [INDC1608X95N]
L7  40R@100MHz  [INDC1608X95N]
R11  1.8K  [RESC1005X40N]
R12  1.8K  [RESC1005X40N]
R13  1K  [RESC1005X40N]
R14  0R  [T_RESC0603X30N]
R15  0R  [T_RESC0603X30N]
R16  0R  [T_RESC0603X30N]
R17  0R  [T_RESC0603X30N]
R18  0R  [T_RESC0603X30N]
R19  0R  [T_RESC0603X30N]
R20  0R  [T_RESC0603X30N]
R21  0R  [T_RESC0603X30N]
R22  0R  [T_RESC0603X30N]
R23  0R  [T_RESC0603X30N]
R25  150R  [RESC1005X40N]
R26  150R  [RESC1005X40N]
R28  150R  [RESC1005X40N]
R76  33R  [RESC1005X40N]
R97  33R  [RESC1005X40N]
R140  1M  [T_RESC0603X30N]
X2  52435-2471  [T_MOLEX_52435-2471]
X4  Manufacturer Part No.: 74320-1004  [T_MOLEX_74320-1004]  (hidden comment: CON-Molex-74320-1004-31)

### Blocks framed on the sheet
Share pads: R14-R23

### Ports
LCD[0..28] (bidir, see 10, 12, 9), VGA[0..2] (bidir, see 10)

### Nets
5V: C95.2 C96.2 D10.1 D10.2 IC3.5(VCC) IC10.5(VCC)
CHASSIS_GND: C136.2 R140.2 X4.X1(SHIELD) X4.X2(SHIELD)
DVI_5V: D10.3 R11.2 R12.2 X4.14(VDD_DVI)
GND: C1.2 C2.2 C3.2 C4.2 C5.2 C6.2 C7.2 C8.2 C95.1 C96.1 C136.1 D1.2 D2.2 D3.2 D4.2 IC3.3(GND) IC10.3(GND) R25.2 R26.2 R28.2 R140.1 X2.1(GND) X2.4(GND) X2.7(GND) X2.10(GND) X2.17(GND) X2.19(GND) X2.21(GND) X4.3(GND) X4.11(GND) X4.15(GND) X4.19(GND) X4.22(GND)
VGA_AGND: C9.2 C10.2 C11.2 X4.C5(GND)
BLUE: C1.1 L6.1 R19.1 R21.1 R26.1
CRT_BLUE: C9.1 D3.3 L6.2 X4.C3(CRT_BLUE)
CRT_BLUE_T: R21.2 X2.22(CRT_BLUE)
CRT_GREEN: C10.1 D3.4 L7.2 X4.C2(CRT_GREEN)
CRT_GREEN_T: R22.2 X2.20(CRT_GREEN)
CRT_HSYNC: C5.1 D3.6 L1.2 X4.C4(CRT_HSYNC)
CRT_HSYNC_T: R17.1 X2.24(CRT_HSYNC)
CRT_RED: C11.1 D4.4 L5.2 X4.C1(CRT_RED)
CRT_RED_T: R23.2 X2.18(CRT_RED)
CRT_VSYNC: C6.1 D3.1 L2.2 X4.8(CRT_VSYNC)
CRT_VSYNC_T: R18.1 X2.23(CRT_VSYNC)
DDC_CLK: C8.1 D4.1 L4.2 X4.6(DDC_CLK)
DDC_CLK_T: L4.1 R11.1 X2.15(DDC_CLK)
DDC_DATA: C7.1 D4.3 L3.2 X4.7(DDC_DATA)
DDC_DATA_T: L3.1 R12.1 X2.16(DDC_DATA)
GREEN: C4.1 L7.1 R20.1 R22.1 R28.1
HOTPLUG_DETECT: C3.1 D4.6 R13.2 X4.16(HOTPLUG_DETECT)
HOTPLUG_DETECT_T: R13.1 X2.14(HOTPLUG_DETECT)
HSYNC: IC3.2(A) R14.2 R17.2
LCD_FCLK_RD: R15.1
LCD_LCLK_A0: R14.1
RED: C2.1 L5.1 R16.1 R23.1 R25.1
TMDS_CLK_N: D2.3 X2.3(TMDS_CLK_N) X4.24(TMDS_CLK_N)
TMDS_CLK_P: D2.4 X2.2(TMDS_CLK_P) X4.23(TMDS_CLK_P)
TMDS_DATA0_N: D2.6 X2.6(TMDS_DATA0_N) X4.17(TMDS_DATA0_N)
TMDS_DATA0_P: D2.1 X2.5(TMDS_DATA0_P) X4.18(TMDS_DATA0_P)
TMDS_DATA1_N: D1.3 X2.9(TMDS_DATA1_N) X4.9(TMDS_DATA1_N)
TMDS_DATA1_P: D1.4 X2.8(TMDS_DATA1_P) X4.10(TMDS_DATA1_P)
TMDS_DATA2_N: D1.6 X2.12(TMDS_DATA2_N) X4.1(TMDS_DATA2_N)
TMDS_DATA2_P: D1.1 X2.11(TMDS_DATA2_P) X4.2(TMDS_DATA2_P)
VGA_BLUE: R19.2
VGA_GREEN: R20.2
VGA_RED: R16.2
VSYNC: IC10.2(A) R15.2 R18.2
NetIC3_4: IC3.4(Y) R97.1
NetIC10_4: IC10.4(Y) R76.1
NetL1_1: L1.1 R97.2
NetL2_1: L2.1 R76.2

Not connected (* = marked no-connect by the designer): D1 5*; D2 5*; D3 5*; D4 5*; IC3 1(NC)*; IC10 1(NC)*; X2 13(VDD)*; X4 4(TMDS_DATA4_N)* 5(TMDS_DATA4_P)* 12(TMDS_DATA3_N)* 13(TMDS_DATA3_P)* 20(TMDS_DATA5_N)* 21(TMDS_DATA5_P)*

### Buses and harness runs
bus LCD[0..28] = port LCD[0..28]
bus TMDS[0..15]
bus VGA[0..2] = port VGA[0..2]

### Layout directives
differential pair: TMDS_CLK_N, TMDS_CLK_P, TMDS_DATA0_N, TMDS_DATA0_P, TMDS_DATA1_N, TMDS_DATA1_P, TMDS_DATA2_N, TMDS_DATA2_P
net class TMDS: TMDS_CLK_N, TMDS_CLK_P, TMDS_DATA0_N, TMDS_DATA0_P, TMDS_DATA1_N, TMDS_DATA1_P, TMDS_DATA2_N, TMDS_DATA2_P

### Notes on the sheet
- (near X2) Colibri HDMI FFC
- (near X4) DVI Connector
- PLACE D1, D2, D3, D4 NEAR THE CONNECTOR
- Title
- Size:
- Date:
- A3
- Number:
- Time:
- Revision:
- Sheet
- of
- File:

### Library data of the parts
C1 C2 C4 C9-C11 = C-NP0-10pF-50V-10%-0402: Capacitor Ceramic NP0 10pF 50V 10% 0402; Tolerance: 10%; Type: NP0; Value: 10pF
C3 = C-X7R-220pF-50V-10%-0402: Capacitor Ceramic X7R 220pF 50V 10% 0402; Tolerance: 10%; Type: X7R; Value: 220pF
C5 C6 = C-NP0-47pF-50V-5%-0402: Capacitor Ceramic NP0 47pF 50V 5% 0402; Tolerance: 5%; Type: NP0; Value: 47pF
C7 C8 = C-NP0-4.7pF-50V-10%-0402: Capacitor Ceramic NP0  4.7pF 50V 10% 0402; Tolerance: 10%; Type: NP0; Value: 4.7pF
C95 C96 = C-X7R-100nF-16V-10%-0402: Capacitor Ceramic X7R 100nF 16V 10% 0402; Tolerance: 10%; Type: X7R; Value: 100nF
C136 = C-X7R-1nF-2KV-10%-1206: Capacitor Ceramic X7R 1nF 2KV 10% 1206; Tolerance: 10%; Type: X7R; Value: 1nF
D1-D4 = D-Semtech-RClamp0504S: TVS Array low cap; Manufacturer Name: Semtech; Manufacturer Part No.: RCLAMP0504S
D10 = D-Philips-BAT54C-Schottky: BAT54C Schottky Diode; Manufacturer Name: Philips; Manufacturer Part No.: BAT54C
IC3 IC10 = IC-TI-SN74LVC1G17DCKR: Schmitt Trigger Buffer, SO-70 package; Manufacturer Name: Texas Instruments; Manufacturer Part No.: SN74LVC1G17DCKR
L1-L4 = L-220R@100MHz-500mA-25%-0402: Ferrite Bead, 220R@100MHz, 500mA, 0402 (1005 metric); Tolerance: 25%; Rating: 500mA; Value: 220R@100MHz
L5-L7 = L-TDK-MMZ1608S400A-40R@100MHz-600mA-25%-0603: 40R@100MHz 600mA EMI FILTER; Manufacturer Name: TDK; Tolerance: 25%; Rating: 600mA; Manufacturer Part No.: MMZ1608S400A; Value: 40R@100MHz
R11 R12 = R-1.8KR-63mW-5%-0402: Resistor 1.8 Kohm 63mW 5% 0402; Value: 1.8KR; Rating: 63mW; Tolerance: 5%
R13 = R-1KR-63mW-5%-0402: Resistor 1 Kohm 63mW 5% 0402; Rating: 63mW; Tolerance: 5%; Value: 1K
R14-R23 = R-0R-63mW-5%-0603: Resistor 0 ohm 63mW 5% 0603; Tolerance: 5%; Value: 0R; Rating: 63mW; Size: 0603 (In)
R25 R26 R28 = R-150R-63mW-5%-0402: Resistor 150 ohm 63mW 5% 0402; Rating: 63mW; Tolerance: 5%; Value: 150R
R76 R97 = R-33R-63mW-5%-0402: Resistor 33 ohm 63mW 5% 0402; Rating: 63mW; Tolerance: 5%; Value: 33R
R140 = R-1MR-63mW-5%-0603: Resistor 1 Mohm 63mW 5% 0603; Value: 1MR; Rating: 63mW; Tolerance: 5%
X2 = CON-Molex-52435-2471-24-0.5mm: 0.50mm Pitch FFC/FPC DVI Connector; Manufacturer Name: Molex; No. of ways: 24; Pitch: 0.5mm; Manufacturer Part No.: 52435-2471
X4 = CON-Molex-74320-1004-31: DVI Connector; Manufacturer Name: Molex; No. of ways: 31

## Sheet RGB-to-VGA.SchDoc: Iris
size A3; Organization: Toradex AG; Address1: Altsagenstrasse 5; Address2: Horw; Address3: 6048; Address4: Switzerland; DocumentNumber: 10; Revision: V2.0; SheetNumber: 10; SheetTotal: 16
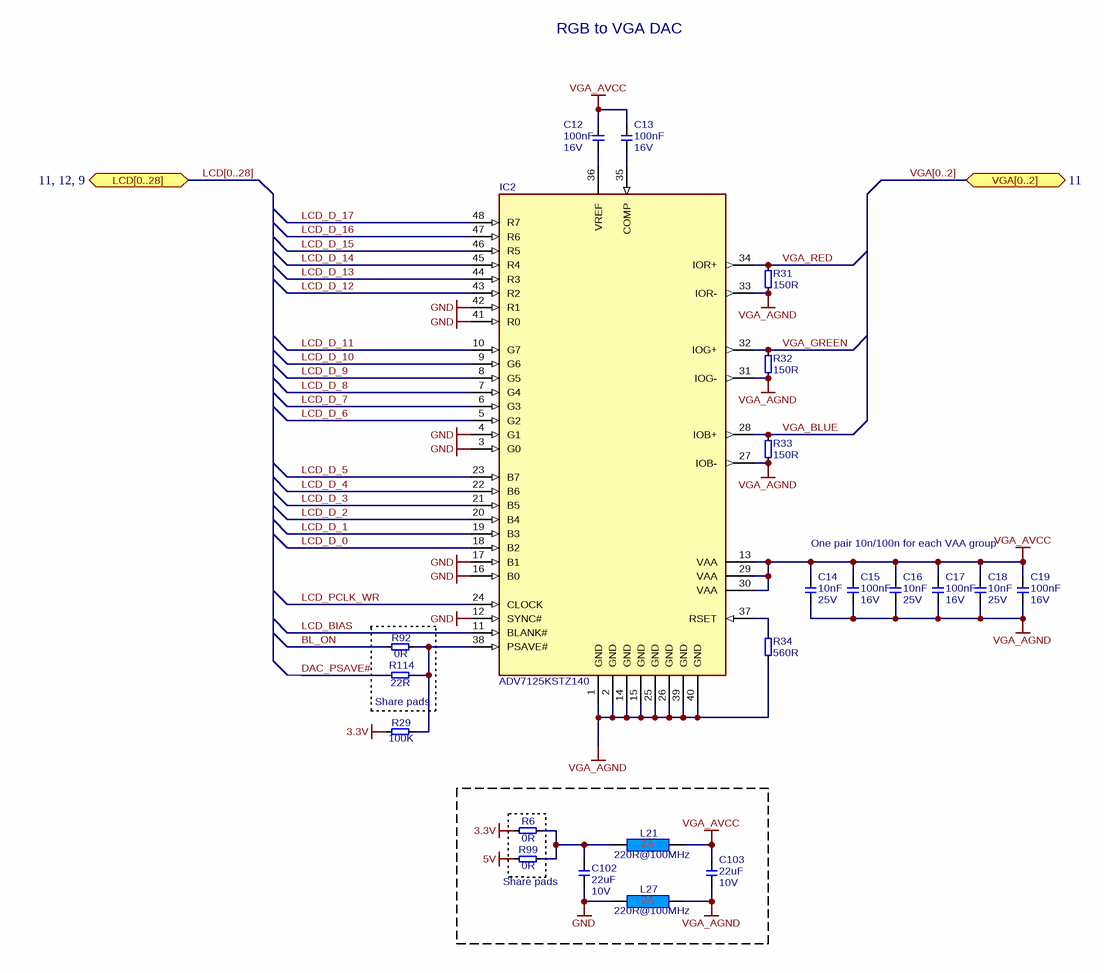
[diagram p15: RGB-to-VGA.SchDoc]

### Parts
C12  Rating: 16V  [CAPC1005X60N]  (hidden comment: 100nF)
C13  Rating: 16V  [CAPC1005X60N]  (hidden comment: 100nF)
C14  Rating: 25V  [CAPC1005X60N]  (hidden comment: 10nF)
C15  Rating: 16V  [CAPC1005X60N]  (hidden comment: 100nF)
C16  Rating: 25V  [CAPC1005X60N]  (hidden comment: 10nF)
C17  Rating: 16V  [CAPC1005X60N]  (hidden comment: 100nF)
C18  Rating: 25V  [CAPC1005X60N]  (hidden comment: 10nF)
C19  Rating: 16V  [CAPC1005X60N]  (hidden comment: 100nF)
C102  Rating: 10V  [T_CAPC0805X125N]  (hidden comment: 22uF)
C103  Rating: 10V  [T_CAPC0805X125N]  (hidden comment: 22uF)
IC2  ADV7125KSTZ140  [QFP50P900X900X120-48N]
L21  220R@100MHz  [INDC1608X95N]
L27  220R@100MHz  [INDC1608X95N]
R6  0R  [T_RESC0603X30N]
R29  100K  [T_RESC0603X30N]
R31  150R  [RESC1005X40N]
R32  150R  [RESC1005X40N]
R33  150R  [RESC1005X40N]
R34  560R  [RESC1005X40N]
R92  0R  [T_RESC0603X30N]
R99  0R  [T_RESC0603X30N]
R114  22R  [T_RESC0603X30N]

### Blocks framed on the sheet
Share pads: R92 R114
Share pads: C102 C103 L21 L27 R6 R99

### Ports
LCD[0..28] (bidir, see 11, 12, 9), VGA[0..2] (bidir, see 11)

### Nets
3.3V: R6.1 R29.1
5V: R99.1
GND: C102.1 IC2.3(G0) IC2.4(G1) IC2.12(SYNC#) IC2.16(B0) IC2.17(B1) IC2.41(R0) IC2.42(R1) L27.1
VGA_AGND: C14.1 C15.1 C16.1 C17.1 C18.1 C19.1 C103.1 IC2.1(GND) IC2.2(GND) IC2.14(GND) IC2.15(GND) IC2.25(GND) IC2.26(GND) IC2.27(IOB-) IC2.31(IOG-) IC2.33(IOR-) IC2.39(GND) IC2.40(GND) L27.2 R31.1 R32.1 R33.1 R34.1
VGA_AVCC: C12.2 C13.2 C14.2 C15.2 C16.2 C17.2 C18.2 C19.2 C103.2 IC2.13(VAA) IC2.29(VAA) IC2.30(VAA) L21.2
BL_ON: R92.1
DAC_PSAVE#: R114.1
LCD_BIAS: IC2.11(BLANK#)
LCD_D_0: IC2.18(B2)
LCD_D_1: IC2.19(B3)
LCD_D_2: IC2.20(B4)
LCD_D_3: IC2.21(B5)
LCD_D_4: IC2.22(B6)
LCD_D_5: IC2.23(B7)
LCD_D_6: IC2.5(G2)
LCD_D_7: IC2.6(G3)
LCD_D_8: IC2.7(G4)
LCD_D_9: IC2.8(G5)
LCD_D_10: IC2.9(G6)
LCD_D_11: IC2.10(G7)
LCD_D_12: IC2.43(R2)
LCD_D_13: IC2.44(R3)
LCD_D_14: IC2.45(R4)
LCD_D_15: IC2.46(R5)
LCD_D_16: IC2.47(R6)
LCD_D_17: IC2.48(R7)
LCD_PCLK_WR: IC2.24(CLOCK)
VGA_BLUE: IC2.28(IOB+) R33.2
VGA_GREEN: IC2.32(IOG+) R32.2
VGA_RED: IC2.34(IOR+) R31.2
NetC12_1: C12.1 IC2.36(VREF)
NetC13_1: C13.1 IC2.35(COMP)
NetC102_2: C102.2 L21.1 R6.2 R99.2
NetIC2_37: IC2.37(RSET) R34.2
NetIC2_38: IC2.38(PSAVE#) R29.2 R92.2 R114.2

### Buses and harness runs
bus LCD[0..28] = port LCD[0..28]
bus VGA[0..2] = port VGA[0..2]

### Notes on the sheet
- RGB to VGA DAC
- One pair 10n/100n for each VAA group
- Title
- Size:
- Date:
- A3
- Number:
- Time:
- Revision:
- Sheet
- of
- File:

### Library data of the parts
C12 C13 C15 C17 C19 = C-X7R-100nF-16V-10%-0402: Capacitor Ceramic X7R 100nF 16V 10% 0402; Tolerance: 10%; Type: X7R; Value: 100nF
C14 C16 C18 = C-X7R-10nF-25V-10%-0402: Capacitor Ceramic X7R 10nF 25V 10% 0402; Tolerance: 10%; Type: X7R; Value: 10nF
C102 C103 = C-X5R-22uF-10V-20%-0805: Capacitor Ceramic X5R 22uF 10V 20% 0805; Tolerance: 20%; Type: X5R; Value: 22uF
IC2 = IC-AD-ADV7125KSTZ140: Video DAC 8bit 140MHz; Manufacturer Name: Analog Devices; Manufacturer Part No.: ADV7125KSTZ140
L21 L27 = L-220R@100MHz-2A-25%-0603: as L17 on sheet USB; Rating: 2A; Value: 220R@100MHz
R6 R92 R99 = R-0R-63mW-5%-0603: Resistor 0 ohm 63mW 5% 0603; Rating: 63mW; Tolerance: 5%; Value: 0R; Size: 0603 (In)
R29 = R-100KR-63mW-5%-0603: as R106 on sheet Serial; Rating: 63mW; Tolerance: 5%
R31-R33 = R-150R-63mW-5%-0402: Resistor 150 ohm 63mW 5% 0402; Rating: 63mW; Tolerance: 5%; Value: 150R
R34 = R-560R-63mW-5%-0402: Resistor 560 ohm 63mW 5% 0402; Rating: 63mW; Tolerance: 5%; Value: 560R
R114 = R-22R-63mW-5%-0603: Resistor 22 ohm 63mW 5% 0603; Rating: 63mW; Tolerance: 5%; Value: 22R

## Sheet LVDS.SchDoc: Iris
size A3; Organization: Toradex AG; Address1: Altsagenstrasse 5; Address2: Horw; Address3: 6048; Address4: Switzerland; DocumentNumber: 12; Revision: V2.0; SheetNumber: 12; SheetTotal: 16
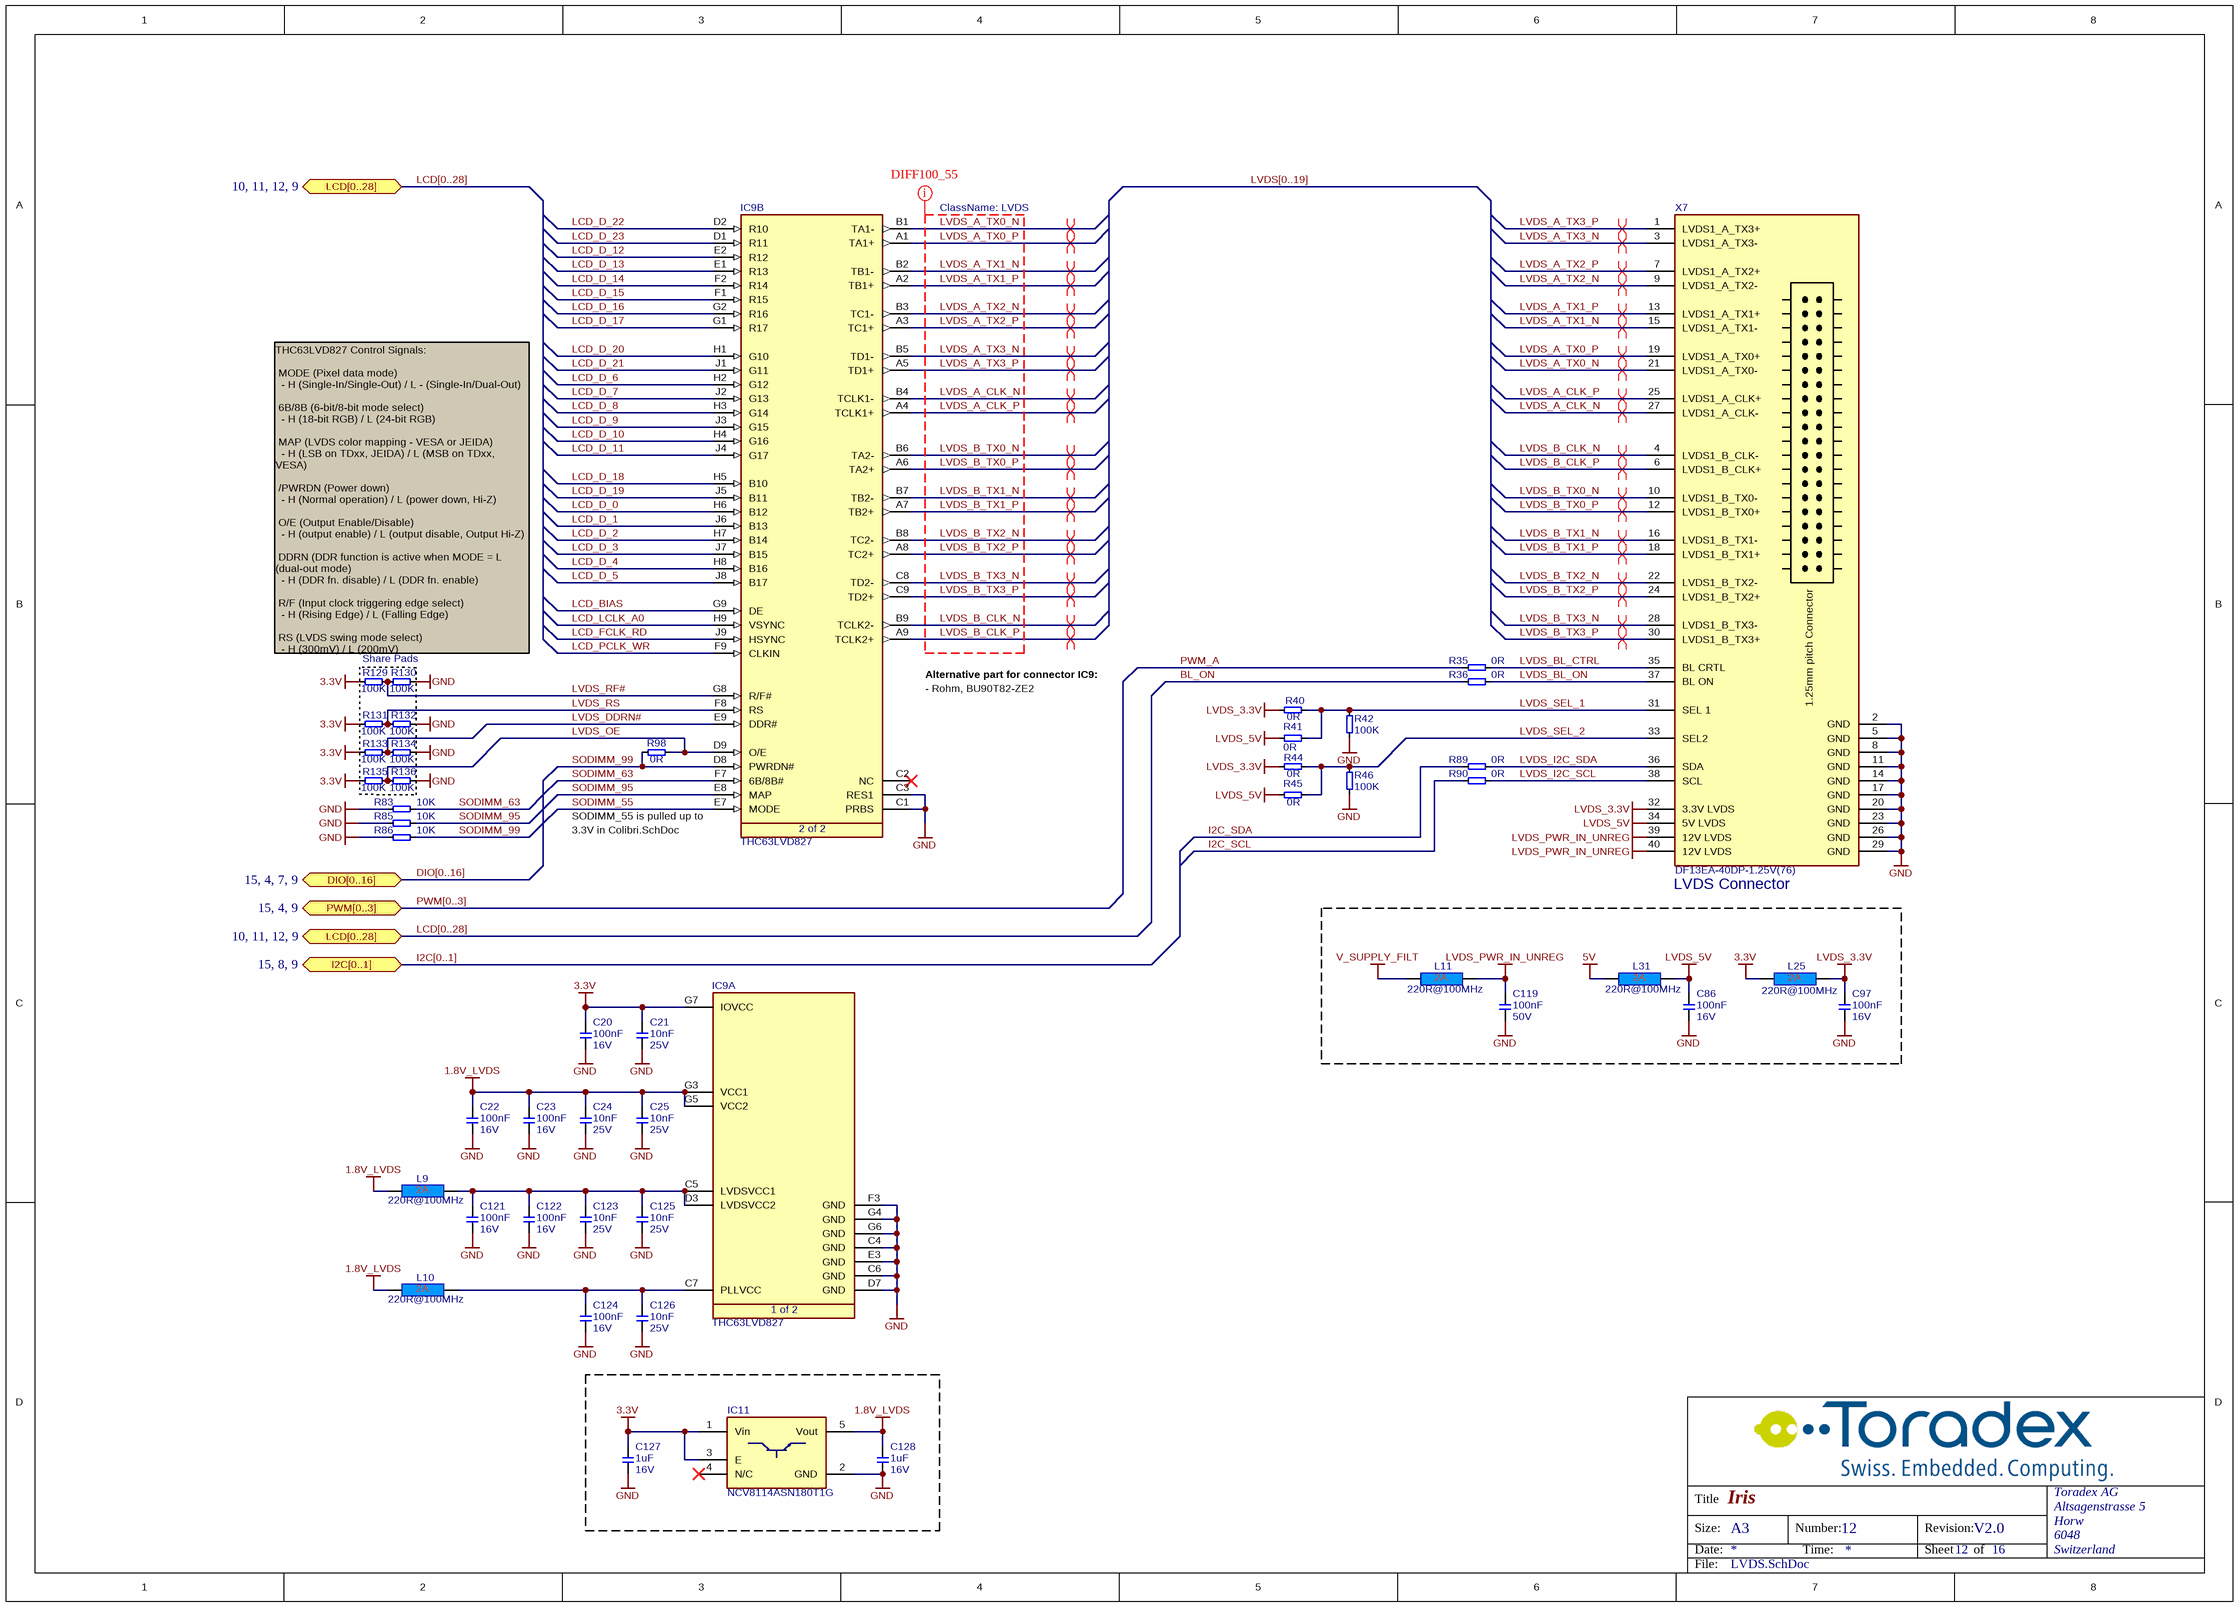
[diagram p16: LVDS.SchDoc]

### Parts
C20  Rating: 16V  [CAPC1005X60N]  (hidden comment: 100nF)
C21  Rating: 25V  [CAPC1005X60N]  (hidden comment: 10nF)
C22  Rating: 16V  [CAPC1005X60N]  (hidden comment: 100nF)
C23  Rating: 16V  [CAPC1005X60N]  (hidden comment: 100nF)
C24  Rating: 25V  [CAPC1005X60N]  (hidden comment: 10nF)
C25  Rating: 25V  [CAPC1005X60N]  (hidden comment: 10nF)
C86  Rating: 16V  [CAPC1005X60N]  (hidden comment: 100nF)
C97  Rating: 16V  [CAPC1005X60N]  (hidden comment: 100nF)
C119  Rating: 50V  [T_CAPC0603X33N]  (hidden comment: 100nF)
C121  Rating: 16V  [CAPC1005X60N]  (hidden comment: 100nF)
C122  Rating: 16V  [CAPC1005X60N]  (hidden comment: 100nF)
C123  Rating: 25V  [CAPC1005X60N]  (hidden comment: 10nF)
C124  Rating: 16V  [CAPC1005X60N]  (hidden comment: 100nF)
C125  Rating: 25V  [CAPC1005X60N]  (hidden comment: 10nF)
C126  Rating: 25V  [CAPC1005X60N]  (hidden comment: 10nF)
C127  Rating: 16V  [T_CAPC0603X33N]  (hidden comment: 1uF)
C128  Rating: 16V  [T_CAPC0603X33N]  (hidden comment: 1uF)
IC9  THC63LVD827  [BGA72C65P9X9_700X700X120]  (parts A,B of 2)
IC11  NCV8114ASN180T1G  [SOT95P279X142-5N]
L9  220R@100MHz  [INDC1608X95N]
L10  220R@100MHz  [INDC1608X95N]
L11  220R@100MHz  [INDC1608X95N]
L25  220R@100MHz  [INDC1608X95N]
L31  220R@100MHz  [INDC1608X95N]
R35  0R  [T_RESC0603X30N]
R36  0R  [T_RESC0603X30N]
R40  0R  [T_RESC0603X30N]
R41  0R  [T_RESC0603X30N]
R42  100K  [T_RESC0603X30N]
R44  0R  [T_RESC0603X30N]
R45  0R  [T_RESC0603X30N]
R46  100K  [T_RESC0603X30N]
R83  10K  [T_RESC0603X30N]
R85  10K  [T_RESC0603X30N]
R86  10K  [T_RESC0603X30N]
R89  0R  [T_RESC0603X30N]
R90  0R  [T_RESC0603X30N]
R98  0R  [T_RESC0603X30N]
R129  100K  [T_RESC0603X30N]
R130  100K  [T_RESC0603X30N]
R131  100K  [T_RESC0603X30N]
R132  100K  [T_RESC0603X30N]
R133  100K  [T_RESC0603X30N]
R134  100K  [T_RESC0603X30N]
R135  100K  [T_RESC0603X30N]
R136  100K  [T_RESC0603X30N]
X7  DF13EA-40DP-1.25V(76)  [T_HIROSE_DF13A-40DP-1.25V(55)]

### Blocks framed on the sheet
Share Pads: R129-R136
LVDS Connector: C86 C97 C119 L11 L25 L31

### Ports
DIO[0..16] (bidir, see 15, 4, 7, 9), I2C[0..1] (bidir, see 15, 8, 9), LCD[0..28] (bidir, see 10, 11, 12, 9), PWM[0..3] (bidir, see 15, 4, 9)

### Nets
1.8V_LVDS: C22.2 C23.2 C24.2 C25.2 C128.2 IC9.G3(VCC1) IC9.G5(VCC2) IC11.5(Vout) L9.1 L10.1
3.3V: C20.2 C21.2 C127.2 IC9.G7(IOVCC) IC11.1(Vin) IC11.3(E) L25.1 R129.1 R131.1 R133.1 R135.1
5V: L31.1
GND: C20.1 C21.1 C22.1 C23.1 C24.1 C25.1 C86.1 C97.1 C119.1 C121.1 C122.1 C123.1 C124.1 C125.1 C126.1 C127.1 C128.1 IC9.C1(PRBS) IC9.C3(RES1) IC9.C4(GND) IC9.C6(GND) IC9.D7(GND) IC9.E3(GND) IC9.F3(GND) IC9.G4(GND) IC9.G6(GND) IC11.2(GND) R42.2 R46.2 R83.2 R85.2 R86.2 R130.2 R132.2 R134.2 R136.2 X7.2(GND) X7.5(GND) X7.8(GND) X7.11(GND) X7.14(GND) X7.17(GND) X7.20(GND) X7.23(GND) X7.26(GND) X7.29(GND)
LVDS_3.3V: C97.2 L25.2 R40.2 R44.1 X7.32(3.3V_LVDS)
LVDS_5V: C86.2 L31.2 R41.1 R45.2 X7.34(5V_LVDS)
LVDS_PWR_IN_UNREG: C119.2 L11.2 X7.39(12V_LVDS) X7.40(12V_LVDS)
V_SUPPLY_FILT: L11.1
BL_ON: R36.2
I2C_SCL: R90.1
I2C_SDA: R89.1
LCD_BIAS: IC9.G9(DE)
LCD_D_0: IC9.H6(B12)
LCD_D_1: IC9.J6(B13)
LCD_D_2: IC9.H7(B14)
LCD_D_3: IC9.J7(B15)
LCD_D_4: IC9.H8(B16)
LCD_D_5: IC9.J8(B17)
LCD_D_6: IC9.H2(G12)
LCD_D_7: IC9.J2(G13)
LCD_D_8: IC9.H3(G14)
LCD_D_9: IC9.J3(G15)
LCD_D_10: IC9.H4(G16)
LCD_D_11: IC9.J4(G17)
LCD_D_12: IC9.E2(R12)
LCD_D_13: IC9.E1(R13)
LCD_D_14: IC9.F2(R14)
LCD_D_15: IC9.F1(R15)
LCD_D_16: IC9.G2(R16)
LCD_D_17: IC9.G1(R17)
LCD_D_18: IC9.H5(B10)
LCD_D_19: IC9.J5(B11)
LCD_D_20: IC9.H1(G10)
LCD_D_21: IC9.J1(G11)
LCD_D_22: IC9.D2(R10)
LCD_D_23: IC9.D1(R11)
LCD_FCLK_RD: IC9.J9(HSYNC)
LCD_LCLK_A0: IC9.H9(VSYNC)
LCD_PCLK_WR: IC9.F9(CLKIN)
LVDS_A_CLK_N: IC9.B4(TCLK1-) X7.27(LVDS1_A_CLK-)
LVDS_A_CLK_P: IC9.A4(TCLK1+) X7.25(LVDS1_A_CLK+)
LVDS_A_TX0_N: IC9.B1(TA1-) X7.21(LVDS1_A_TX0-)
LVDS_A_TX0_P: IC9.A1(TA1+) X7.19(LVDS1_A_TX0+)
LVDS_A_TX1_N: IC9.B2(TB1-) X7.15(LVDS1_A_TX1-)
LVDS_A_TX1_P: IC9.A2(TB1+) X7.13(LVDS1_A_TX1+)
LVDS_A_TX2_N: IC9.B3(TC1-) X7.9(LVDS1_A_TX2-)
LVDS_A_TX2_P: IC9.A3(TC1+) X7.7(LVDS1_A_TX2+)
LVDS_A_TX3_N: IC9.B5(TD1-) X7.3(LVDS1_A_TX3-)
LVDS_A_TX3_P: IC9.A5(TD1+) X7.1(LVDS1_A_TX3+)
LVDS_B_CLK_N: IC9.B9(TCLK2-) X7.4(LVDS1_B_CLK-)
LVDS_B_CLK_P: IC9.A9(TCLK2+) X7.6(LVDS1_B_CLK+)
LVDS_B_TX0_N: IC9.B6(TA2-) X7.10(LVDS1_B_TX0-)
LVDS_B_TX0_P: IC9.A6(TA2+) X7.12(LVDS1_B_TX0+)
LVDS_B_TX1_N: IC9.B7(TB2-) X7.16(LVDS1_B_TX1-)
LVDS_B_TX1_P: IC9.A7(TB2+) X7.18(LVDS1_B_TX1+)
LVDS_B_TX2_N: IC9.B8(TC2-) X7.22(LVDS1_B_TX2-)
LVDS_B_TX2_P: IC9.A8(TC2+) X7.24(LVDS1_B_TX2+)
LVDS_B_TX3_N: IC9.C8(TD2-) X7.28(LVDS1_B_TX3-)
LVDS_B_TX3_P: IC9.C9(TD2+) X7.30(LVDS1_B_TX3+)
LVDS_BL_CTRL: R35.1 X7.35(BL_CRTL)
LVDS_BL_ON: R36.1 X7.37(BL_ON)
LVDS_DDRN#: IC9.E9(DDR#) R133.2 R134.1
LVDS_I2C_SCL: R90.2 X7.38(SCL)
LVDS_I2C_SDA: R89.2 X7.36(SDA)
LVDS_OE: IC9.D9(O/E) R98.2 R135.2 R136.1
LVDS_RF#: IC9.G8(R/F#) R129.2 R130.1
LVDS_RS: IC9.F8(RS) R131.2 R132.1
LVDS_SEL_1: R40.1 R41.2 R42.1 X7.31(SEL_1)
LVDS_SEL_2: R44.2 R45.1 R46.1 X7.33(SEL2)
PWM_A: R35.2
SODIMM_55: IC9.E7(MODE)
SODIMM_63: IC9.F7(6B/8B#) R83.1
SODIMM_95: IC9.E8(MAP) R85.1
SODIMM_99: IC9.D8(PWRDN#) R86.1 R98.1
NetC121_2: C121.2 C122.2 C123.2 C125.2 IC9.C5(LVDSVCC1) IC9.D3(LVDSVCC2) L9.2
NetC124_2: C124.2 C126.2 IC9.C7(PLLVCC) L10.2

Not connected (* = marked no-connect by the designer): IC9 C2(NC)*; IC11 4(N/C)*

### Buses and harness runs
bus DIO[0..16] = port DIO[0..16]
bus I2C[0..1] = port I2C[0..1]
bus LCD[0..28] = port LCD[0..28]
bus LVDS[0..19]
bus PWM[0..3] = port PWM[0..3]

### Layout directives
differential pair: LVDS_A_CLK_N, LVDS_A_CLK_P, LVDS_A_TX0_N, LVDS_A_TX0_P, LVDS_A_TX1_N, LVDS_A_TX1_P, LVDS_A_TX2_N, LVDS_A_TX2_P, LVDS_A_TX3_N, LVDS_A_TX3_P, LVDS_B_CLK_N, LVDS_B_CLK_P, LVDS_B_TX0_N, LVDS_B_TX0_P, LVDS_B_TX1_N, LVDS_B_TX1_P, LVDS_B_TX2_N, LVDS_B_TX2_P, LVDS_B_TX3_N, LVDS_B_TX3_P
net class LVDS: LVDS_A_CLK_N, LVDS_A_CLK_P, LVDS_A_TX0_N, LVDS_A_TX0_P, LVDS_A_TX1_N, LVDS_A_TX1_P, LVDS_A_TX2_N, LVDS_A_TX2_P, LVDS_A_TX3_N, LVDS_A_TX3_P, LVDS_B_CLK_N, LVDS_B_CLK_P, LVDS_B_TX0_N, LVDS_B_TX0_P, LVDS_B_TX1_N, LVDS_B_TX1_P, LVDS_B_TX2_N, LVDS_B_TX2_P, LVDS_B_TX3_N, LVDS_B_TX3_P

### Notes on the sheet
- THC63LVD827 Control Signals:
  MODE (Pixel data mode)
  - H (Single-In/Single-Out) / L - (Single-In/Dual-Out)
  6B/8B (6-bit/8-bit mode select)
  - H (18-bit RGB) / L (24-bit RGB)
  MAP (LVDS color mapping - VESA or JEIDA)
  - H (LSB on TDxx, JEIDA) / L (MSB on TDxx, VESA)
  /PWRDN (Power down)
  - H (Normal operation) / L (power down, Hi-Z)
  O/E (Output Enable/Disable)
  - H (output enable) / L (output disable, Output Hi-Z)
  DDRN (DDR function is active when MODE = L (dual-out mode)
  - H (DDR fn. disable) / L (DDR fn. enable)
  R/F (Input clock triggering edge select)
  - H (Rising Edge) / L (Falling Edge)
  RS (LVDS swing mode select)
  - H (300mV) / L (200mV)
- (near IC9) Alternative part for connector IC9:
- (near IC9) - Rohm, BU90T82-ZE2
- SODIMM_55 is pulled up to
- 3.3V in Colibri.SchDoc
- Title
- Size:
- Date:
- A3
- Number:
- Time:
- Revision:
- Sheet
- of
- File:
- (in symbol CON-Hirose-DF13EA-40DP-1.25V(76)) 1.25mm pitch Connector
- (in symbol IC-THine-THC63LVD827, part A) 1 of 2
- (in symbol IC-THine-THC63LVD827, part B) 2 of 2

### Library data of the parts
C20 C22 C23 C86 C97 C121 C122 C124 = C-X7R-100nF-16V-10%-0402: Capacitor Ceramic X7R 100nF 16V 10% 0402; Tolerance: 10%; Type: X7R; Value: 100nF
C21 C24 C25 C123 C125 C126 = C-X7R-10nF-25V-10%-0402: Capacitor Ceramic X7R 10nF 25V 10% 0402; Tolerance: 10%; Type: X7R; Value: 10nF
C119 = C-X7R-100nF-50V-10%-0603: Capacitor Ceramic X7R 100nF 50V 10% 0603; Tolerance: 10%; Type: X7R; Value: 100nF
C127 C128 = C-X5R-1uF-16V-10%-0603: Capacitor Ceramic X5R 1uF 16V 10% 0603; Tolerance: 10%; Type: X5R; Value: 1uF
IC9 = IC-THine-THC63LVD827: LVDS Transmitter; Manufacturer Name: Thine; Manufacturer Part No.: THC63LVD827
IC11 = IC-OnSemi-NCV8114ASN180T1G: LDO regulator, Vout = 1.8V, Imax = 300mA; Manufacturer Name: ON Semiconductor; Manufacturer Part No.: NCV8114ASN180T1G
L9-L11 L25 L31 = L-220R@100MHz-2A-25%-0603: as L17 on sheet USB; Rating: 2A; Value: 220R@100MHz
R35 R36 R40 R41 R44 R45 R89 R90 R98 = R-0R-63mW-5%-0603: Resistor 0 ohm 63mW 5% 0603; Tolerance: 5%; Value: 0R; Rating: 63mW; Size: 0603 (In)
R42 R46 R129-R136 = R-100KR-63mW-5%-0603: as R106 on sheet Serial; Rating: 63mW; Tolerance: 5%
R83 R85 R86 = R-10KR-63mW-5%-0603: Resistor 10 Kohm 63mW 5% 0603; Value: 10KR; Rating: 63mW; Tolerance: 5%
X7 = CON-Hirose-DF13EA-40DP-1.25V(76): LVDS Connector, 2x20 pin, 1.25mm pitch, SMD; Manufacturer Name: Hirose; No. of ways: 2x20; Pitch: 1.25mm; Manufacturer Part No.: DF13EA-40DP-1.25V(76)

## Nets that join several sheets
3.3V: Colibri (16 pins), PowerSupply (9 pins), DisplayInterface (8 pins), SDCard (5 pins), Extension (C118.2 X16.33), Ethernet (L19.1 X15.9 X15.12), Audio (IC7.3), USB (R49.2 R50.2 R61.2), Serial (8 pins), RTC (10 pins), RGB-to-VGA (R6.1 R29.1), LVDS (11 pins)
5V: PowerSupply (9 pins), Extension (C117.2 X16.12), Audio (C84.2 IC7.1), USB (IC1.2), DVI (6 pins), RGB-to-VGA (R99.1), LVDS (L31.1)
AUDIO_AGND: Colibri (X1.9 X1.11), Extension (X16.26), Audio (14 pins)
AUDIO_AVCC: Colibri (X1.10 X1.12), Audio (C85.2 IC7.5 R38.1 X9.1)
CHASSIS_GND: Colibri (SW1.5), PowerSupply (8 pins), Ethernet (5 pins), USB (9 pins), DVI (C136.2 R140.2 X4.X1 X4.X2)
GND: Colibri (16 pins), PowerSupply (48 pins), DisplayInterface (17 pins), SDCard (12 pins), Extension (7 pins), Ethernet (9 pins), Audio (C28.2 C35.1 C84.1 L24.2), USB (20 pins), Serial (10 pins), RTC (9 pins), DVI (33 pins), RGB-to-VGA (9 pins), LVDS (46 pins)
V_SUPPLY_FILT: PowerSupply (22 pins), LVDS (L11.1)
VGA_AGND: DVI (C9.2 C10.2 C11.2 X4.C5), RGB-to-VGA (23 pins)
ANALOG_IN0: Colibri (X1.8), Extension (X16.25)
ANALOG_IN1: Colibri (X1.6), Extension (X16.24)
ANALOG_IN2: Colibri (X1.4), Extension (X16.23)
ANALOG_IN3: Colibri (X1.2), DisplayInterface (R88.2), Extension (X16.22)
BL_ON: DisplayInterface (R78.2 X3.5), RGB-to-VGA (R92.1), LVDS (R36.2)
DAC_PSAVE#: Colibri (X1.73), RGB-to-VGA (R114.1)
I2C_SCL: DisplayInterface (X5.2), Extension (X16.6), RTC (IC8.6 IC12.6 R54.1 RA14.8), LVDS (R90.1)
I2C_SDA: DisplayInterface (X5.1), Extension (X16.5), RTC (IC8.5 IC12.5 R55.1 RA14.7), LVDS (R89.1)
LCD_BIAS: DisplayInterface (RA1.5 X3.32), RGB-to-VGA (IC2.11), LVDS (IC9.G9)
LCD_D_0: DisplayInterface (RA9.5 X3.13), RGB-to-VGA (IC2.18), LVDS (IC9.H6)
LCD_D_1: DisplayInterface (RA7.6 X3.12), RGB-to-VGA (IC2.19), LVDS (IC9.J6)
LCD_D_2: DisplayInterface (RA5.5 X3.11), RGB-to-VGA (IC2.20), LVDS (IC9.H7)
LCD_D_3: DisplayInterface (RA3.8 X3.10), RGB-to-VGA (IC2.21), LVDS (IC9.J7)
LCD_D_4: DisplayInterface (RA9.6 X3.9), RGB-to-VGA (IC2.22), LVDS (IC9.H8)
LCD_D_5: DisplayInterface (RA7.7 X3.8), RGB-to-VGA (IC2.23), LVDS (IC9.J8)
LCD_D_6: DisplayInterface (RA9.7 X3.20), RGB-to-VGA (IC2.5), LVDS (IC9.H2)
LCD_D_7: DisplayInterface (RA1.6 X3.19), RGB-to-VGA (IC2.6), LVDS (IC9.J2)
LCD_D_8: DisplayInterface (RA5.6 X3.18), RGB-to-VGA (IC2.7), LVDS (IC9.H3)
LCD_D_9: DisplayInterface (RA1.7 X3.17), RGB-to-VGA (IC2.8), LVDS (IC9.J3)
LCD_D_10: DisplayInterface (RA7.8 X3.16), RGB-to-VGA (IC2.9), LVDS (IC9.H4)
LCD_D_11: DisplayInterface (RA1.8 X3.15), RGB-to-VGA (IC2.10), LVDS (IC9.J4)
LCD_D_12: DisplayInterface (RA3.5 X3.27), RGB-to-VGA (IC2.43), LVDS (IC9.E2)
LCD_D_13: DisplayInterface (RA3.6 X3.26), RGB-to-VGA (IC2.44), LVDS (IC9.E1)
LCD_D_14: DisplayInterface (RA5.8 X3.25), RGB-to-VGA (IC2.45), LVDS (IC9.F2)
LCD_D_15: DisplayInterface (RA5.7 X3.24), RGB-to-VGA (IC2.46), LVDS (IC9.F1)
LCD_D_16: DisplayInterface (RA15.5 X3.23), RGB-to-VGA (IC2.47), LVDS (IC9.G2)
LCD_D_17: DisplayInterface (RA15.6 X3.22), RGB-to-VGA (IC2.48), LVDS (IC9.G1)
LCD_D_18: DisplayInterface (RA15.7), LVDS (IC9.H5)
LCD_D_19: DisplayInterface (RA15.8), LVDS (IC9.J5)
LCD_D_20: DisplayInterface (RA16.5), LVDS (IC9.H1)
LCD_D_21: DisplayInterface (RA16.6), LVDS (IC9.J1)
LCD_D_22: DisplayInterface (RA16.7), LVDS (IC9.D2)
LCD_D_23: DisplayInterface (RA16.8), LVDS (IC9.D1)
LCD_FCLK_RD: DisplayInterface (RA9.8 X3.31), DVI (R15.1), LVDS (IC9.J9)
LCD_LCLK_A0: DisplayInterface (RA7.5 X3.30), DVI (R14.1), LVDS (IC9.H9)
LCD_PCLK_WR: DisplayInterface (RA3.7 X3.28), RGB-to-VGA (IC2.24), LVDS (IC9.F9)
PWM_A: Colibri (R7.2), DisplayInterface (X3.6), Extension (R84.1), LVDS (R35.2)
PWM_B: Colibri (R79.2), Extension (X16.38)
PWM_C: Colibri (R80.2), Extension (X16.39)
PWM_D: Colibri (R10.2), Extension (X16.40)
RESET_EXT#: Colibri (SW1.2 SW1.4 X1.26), Extension (X16.1)
RESET_OUT#: Colibri (RA13.6), DisplayInterface (R39.1), Extension (X16.4)
SODIMM_45: Colibri (RA2.7), Extension (X16.20)
SODIMM_55: Colibri (R9.2 R120.2), LVDS (IC9.E7)
SODIMM_63: Colibri (R119.2 RA11.8), LVDS (IC9.F7 R83.1)
SODIMM_79: Colibri (RA13.8), Extension (X16.19)
SODIMM_85: Colibri (RA13.7), Extension (X16.18)
SODIMM_95: Colibri (RA11.5), LVDS (IC9.E8 R85.1)
SODIMM_97: Colibri (RA11.6), Extension (X16.17)
SODIMM_98: Colibri (RA4.5), Extension (X16.13)
SODIMM_99: Colibri (R2.2), LVDS (IC9.D8 R86.1 R98.1)
SODIMM_100: Colibri (RA4.6), SDCard (IC13.4 R145.1)
SODIMM_101: Colibri (RA11.7), Extension (X16.16)
SODIMM_102: Colibri (RA4.7), Serial (IC4.22 R106.2)
SODIMM_103: Colibri (R148.2), Extension (X16.15)
SODIMM_104: Colibri (RA4.8), Serial (IC6.22 R107.2)
SODIMM_106: Colibri (R149.2), DisplayInterface (X5.5)
SODIMM_107: Colibri (R146.2), DisplayInterface (X5.4)
SODIMM_133: Colibri (R147.2), Extension (X16.14)
SSPFRM: Colibri (RA6.5), DisplayInterface (R126.1), Extension (X16.9)
SSPRXD: Colibri (RA6.7), DisplayInterface (R128.1), Extension (X16.10)
SSPSCLK: Colibri (RA6.6), DisplayInterface (R125.1), Extension (X16.8)
SSPTXD: Colibri (RA6.8), DisplayInterface (R127.1), Extension (X16.11)
UART_A_RXD: Extension (X16.28), Serial (IC4.16 RA10.7)
UART_A_TXD: Extension (X16.27), Serial (IC4.13 RA10.6)
UART_B_CTS: Extension (X16.29), Serial (IC6.15 RA12.5)
UART_B_RTS: Extension (X16.30), Serial (IC6.14 RA12.6)
UART_B_RXD: Extension (X16.31), Serial (IC6.16 RA12.7)
UART_B_TXD: Extension (X16.32), Serial (IC6.13 RA12.8)
UART_C_RXD: Extension (X16.34), Serial (IC6.19 R4.2)
UART_C_TXD: Extension (X16.35), Serial (IC6.12 R5.2)
VGA_BLUE: DVI (R19.2), RGB-to-VGA (IC2.28 R33.2)
VGA_GREEN: DVI (R20.2), RGB-to-VGA (IC2.32 R32.2)
VGA_RED: DVI (R16.2), RGB-to-VGA (IC2.34 R31.2)

## Assembly variants
Assembly Variant of Iris V2.0A: not fitted C28 C35 C56 C57 C65 C66 C74 C75 C132 IC12 JP1 R17 R18 R21 R22 R23 R30 R41 R42 R43 R45 R46 R58 R59 R60 R65 R69 R75 R92 R98 R99 R101 R102 R103 R104 R105 R109 R110 R111 R112 R113 R117 R118 R119 R121 R125 R126 R127 R128 R130 R132 R134 R136 R139 R141 R142 R143 R144 R151 R153 R157 R158 X6 X20